# EAGLE design owl-digital-2 (EAGLE 9.6.1)
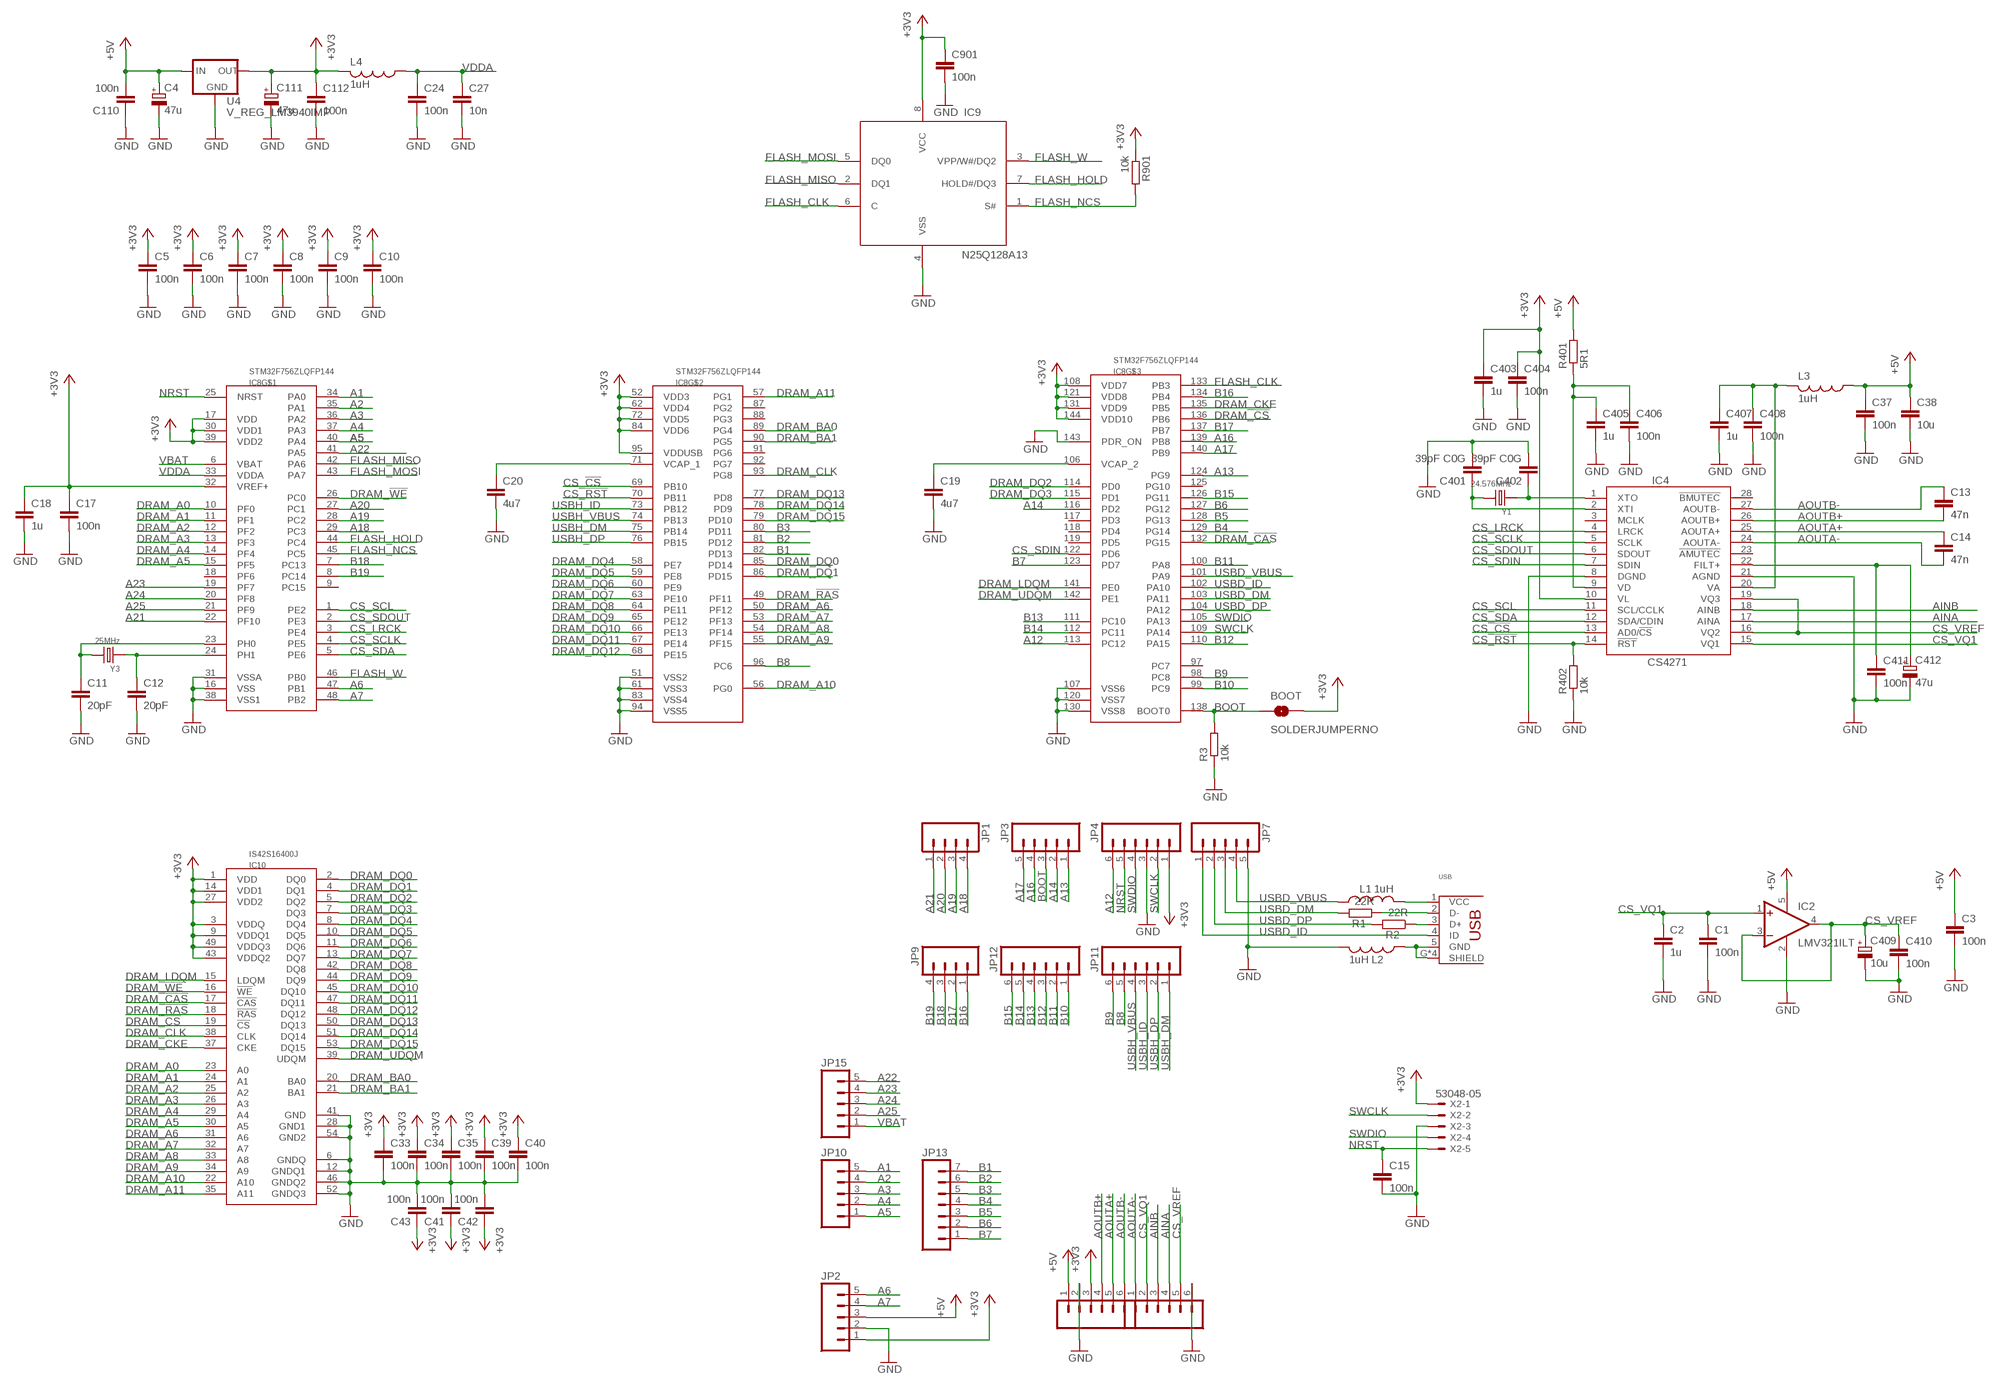
[diagram p0: schematic, sheet 1]

## Parts
BOOT  SOLDERJUMPERNO  [SJ_2S-NO]
C1  100n  C-EUC0603  [C0603]
C2  1u  C-EUC0603  [C0603]
C3  100n  C-EUC0603  [C0603]
C4  47u  CPOL-EU153CLV-0505  [CPOL-5]
C5  100n  C-EUC0603  [C0603]
C6  100n  C-EUC0603  [C0603]
C7  100n  C-EUC0603  [C0603]
C8  100n  C-EUC0603  [C0603]
C9  100n  C-EUC0603  [C0603]
C10  100n  C-EUC0603  [C0603]
C11  20pF  C-EUC0603  [C0603]
C12  20pF  C-EUC0603  [C0603]
C13  47n  C-EUC0603  [C0603]
C14  47n  C-EUC0603  [C0603]
C15  100n  C-EUC0603  [C0603]
C17  100n  C-EUC0603  [C0603]
C18  1u  C-EUC0603  [C0603]
C19  4u7  C-EUC0603  [C0603]
C20  4u7  C-EUC0603  [C0603]
C24  100n  C-EUC0603  [C0603]
C27  10n  C-EUC0603  [C0603]
C33  100n  C-EUC0603  [C0603]
C34  100n  C-EUC0603  [C0603]
C35  100n  C-EUC0603  [C0603]
C37  100n  C-EUC0603  [C0603]
C38  10u  C-EUC1206  [C1206]
C39  100n  C-EUC0603  [C0603]
C40  100n  C-EUC0603  [C0603]
C41  100n  C-EUC0603  [C0603]
C42  100n  C-EUC0603  [C0603]
C43  100n  C-EUC0603  [C0603]
C110  100n  C-EUC0603  [C0603]
C111  47u  CPOL-EU153CLV-0505  [CPOL-5]
C112  100n  C-EUC0603  [C0603]
C401  39pF C0G  C-EUC0603  [C0603]
C402  39pF C0G  C-EUC0603  [C0603]
C403  1u  C-EUC0603  [C0603]
C404  100n  C-EUC0603  [C0603]
C405  1u  C-EUC0603  [C0603]
C406  100n  C-EUC0603  [C0603]
C407  1u  C-EUC0603  [C0603]
C408  100n  C-EUC0603  [C0603]
C409  10u  CPOL-EU153CLV-0505  [CPOL-5]
C410  100n  C-EUC0603  [C0603]
C411  100n  C-EUC0603  [C0603]
C412  47u  CPOL-EU153CLV-0505  [CPOL-5]
C901  100n  C-EUC0603  [C0603]
IC2  LMV321ILT  LM321MF  [SOT23-5]
IC4  CS4271  [TSSOP28-0.65-9.7X4.4MM]
IC8  STM32F756ZLQFP144  [QFP50P2200X2200X160-144N]
IC9  N25Q128A13  [SO8W]
IC10  IS42S16400J  [TSOP54-400]
JP1  M04PTH  [1X04]
JP2  M05PTH  [1X05]
JP3  M05PTH  [1X05]
JP4  M06SIP  [1X06]
JP5  M06SIP  [1X06]
JP6  M06SIP  [1X06]
JP7  M05PTH  [1X05]
JP9  M04PTH  [1X04]
JP10  M05PTH  [1X05]
JP11  M06SIP  [1X06]
JP12  M06SIP  [1X06]
JP13  M07  [1X07]
JP15  M05PTH  [1X05]
L1  1uH  INDUCTOR  [0603]
L2  1uH  INDUCTOR  [0603]
L3  1uH  INDUCTOR  [0603]
L4  1uH  INDUCTOR  [0603]
R1  22R  R-EU_0603  [0603]
R2  22R  R-EU_0603  [0603]
R3  10k  R-EU_0603  [0603]
R401  5R1  R-EU_0603  [0603]
R402  10k  R-EU_0603  [0603]
R901  10k  R-EU_0603  [0603]
U4  V_REG_LM3940IMP  [SOT223]
USB  USB_HRS_ZX62-B-5PA(11)MICRO.B  [HRS_ZX62RD-AB-5P8]
X2  53048-05  [53048-05]
Y1  24.576MHz  SMD-CRYSTAL-8MHZ-20PF-20PPM(2P-5.0X3.2MM)  [X2-SMD-5.0X3.2X1.3MM]
Y3  25MHz  SMD-CRYSTAL-8MHZ-20PF-20PPM(2P-5.0X3.2MM)  [X2-SMD-5.0X3.2X1.3MM]

## Nets
+3V3: BOOT.2 C5.1 C6.1 C7.1 C8.1 C9.1 C10.1 C17.1 C18.1 C33.1 C34.1 C35.1 C39.1 C40.1 C41.1 C42.1 C43.1 C111.+ C112.1 C403.1 C404.1 C901.1 IC4.10(VL) IC8.17(VDD) IC8.30(VDD1) IC8.32(VREF+) IC8.39(VDD2) IC8.52(VDD3) IC8.62(VDD4) IC8.72(VDD5) IC8.84(VDD6) IC8.95(VDDUSB) IC8.108(VDD7) IC8.121(VDD8) IC8.131(VDD9) IC8.144(VDD10) IC9.8(VCC) IC10.1(VDD) IC10.3(VDDQ) IC10.9(VDDQ1) IC10.14(VDD1) IC10.27(VDD2) IC10.43(VDDQ2) IC10.49(VDDQ3) JP2.1 JP4.1 JP5.3 L4.2 R901.1 U4.3(OUT) X2.1
+5V [power]: C3.1 C4.+ C37.1 C38.1 C110.2 IC2.5(V+) JP2.3 JP5.1 L3.1 R401.2 U4.1(IN)
A1: IC8.34(PA0) JP10.5
A2: IC8.35(PA1) JP10.4
A3: IC8.36(PA2) JP10.3
A4: IC8.37(PA3) JP10.2
A5: IC8.40(PA4) JP10.1
A6: IC8.47(PB1) JP2.5
A7: IC8.48(PB2) JP2.4
A12: IC8.113(PC12) JP4.6
A13: IC8.124(PG9) JP3.1
A14: IC8.116(PD2) JP3.2
A16: IC8.139(PB8) JP3.4
A17: IC8.140(PB9) JP3.5
A18: IC8.29(PC3) JP1.4
A19: IC8.28(PC2) JP1.3
A20: IC8.27(PC1) JP1.2
A21: IC8.22(PF10) JP1.1
A22: IC8.41(PA5) JP15.5
A23: IC8.19(PF7) JP15.4
A24: IC8.20(PF8) JP15.3
A25: IC8.21(PF9) JP15.2
AINA: IC4.17(AINA) JP6.4
AINB: IC4.18(AINB) JP6.3
AOUTA+: C14.1 IC4.25(AOUTA+) JP5.5
AOUTA-: C14.2 IC4.24(AOUTA-) JP6.1
AOUTB+: C13.2 IC4.26(AOUTB+) JP5.4
AOUTB-: C13.1 IC4.27(AOUTB-) JP5.6
B1: IC8.82(PD13) JP13.7
B2: IC8.81(PD12) JP13.6
B3: IC8.80(PD11) JP13.5
B4: IC8.129(PG14) JP13.4
B5: IC8.128(PG13) JP13.3
B6: IC8.127(PG12) JP13.2
B7: IC8.123(PD7) JP13.1
B8: IC8.96(PC6) JP11.5
B9: IC8.98(PC8) JP11.6
B10: IC8.99(PC9) JP12.1
B11: IC8.100(PA8) JP12.2
B12: IC8.110(PA15) JP12.3
B13: IC8.111(PC10) JP12.4
B14: IC8.112(PC11) JP12.5
B15: IC8.126(PG11) JP12.6
B16: IC8.134(PB4) JP9.1
B17: IC8.137(PB7) JP9.2
B18: IC8.7(PC13) JP9.3
B19: IC8.8(PC14) JP9.4
BOOT: BOOT.1 IC8.138(BOOT0) JP3.3 R3.2
CS_!CS: IC4.13(AD0/!CS) IC8.69(PB10)
CS_!RST: IC4.14(!RST) IC8.70(PB11) R402.2
CS_LRCK: IC4.4(LRCK) IC8.3(PE4)
CS_SCL: IC4.11(SCL/CCLK) IC8.1(PE2)
CS_SCLK: IC4.5(SCLK) IC8.4(PE5)
CS_SDA: IC4.12(SDA/CDIN) IC8.5(PE6)
CS_SDIN: IC4.7(SDIN) IC8.122(PD6)
CS_SDOUT: IC4.6(SDOUT) IC8.2(PE3)
CS_VQ1: C1.1 C2.1 IC2.1(+IN) IC4.15(VQ1) JP6.2
CS_VREF: C409.+ C410.1 IC2.3(-IN) IC2.4(OUT) IC4.16(VQ2) IC4.19(VQ3) JP6.5
DRAM_!CAS: IC8.132(PG15) IC10.17(!CAS)
DRAM_!CS: IC8.136(PB6) IC10.19(!CS)
DRAM_!RAS: IC8.49(PF11) IC10.18(!RAS)
DRAM_!WE: IC8.26(PC0) IC10.16(!WE)
DRAM_A0: IC8.10(PF0) IC10.23(A0)
DRAM_A1: IC8.11(PF1) IC10.24(A1)
DRAM_A2: IC8.12(PF2) IC10.25(A2)
DRAM_A3: IC8.13(PF3) IC10.26(A3)
DRAM_A4: IC8.14(PF4) IC10.29(A4)
DRAM_A5: IC8.15(PF5) IC10.30(A5)
DRAM_A6: IC8.50(PF12) IC10.31(A6)
DRAM_A7: IC8.53(PF13) IC10.32(A7)
DRAM_A8: IC8.54(PF14) IC10.33(A8)
DRAM_A9: IC8.55(PF15) IC10.34(A9)
DRAM_A10: IC8.56(PG0) IC10.22(A10)
DRAM_A11: IC8.57(PG1) IC10.35(A11)
DRAM_BA0: IC8.89(PG4) IC10.20(BA0)
DRAM_BA1: IC8.90(PG5) IC10.21(BA1)
DRAM_CKE: IC8.135(PB5) IC10.37(CKE)
DRAM_CLK: IC8.93(PG8) IC10.38(CLK)
DRAM_DQ0: IC8.85(PD14) IC10.2(DQ0)
DRAM_DQ1: IC8.86(PD15) IC10.4(DQ1)
DRAM_DQ2: IC8.114(PD0) IC10.5(DQ2)
DRAM_DQ3: IC8.115(PD1) IC10.7(DQ3)
DRAM_DQ4: IC8.58(PE7) IC10.8(DQ4)
DRAM_DQ5: IC8.59(PE8) IC10.10(DQ5)
DRAM_DQ6: IC8.60(PE9) IC10.11(DQ6)
DRAM_DQ7: IC8.63(PE10) IC10.13(DQ7)
DRAM_DQ8: IC8.64(PE11) IC10.42(DQ8)
DRAM_DQ9: IC8.65(PE12) IC10.44(DQ9)
DRAM_DQ10: IC8.66(PE13) IC10.45(DQ10)
DRAM_DQ11: IC8.67(PE14) IC10.47(DQ11)
DRAM_DQ12: IC8.68(PE15) IC10.48(DQ12)
DRAM_DQ13: IC8.77(PD8) IC10.50(DQ13)
DRAM_DQ14: IC8.78(PD9) IC10.51(DQ14)
DRAM_DQ15: IC8.79(PD10) IC10.53(DQ15)
DRAM_LDQM: IC8.141(PE0) IC10.15(LDQM)
DRAM_UDQM: IC8.142(PE1) IC10.39(UDQM)
FLASH_CLK: IC8.133(PB3) IC9.6(C)
FLASH_HOLD: IC8.44(PC4) IC9.7(HOLD#/DQ3)
FLASH_MISO: IC8.42(PA6) IC9.2(DQ1)
FLASH_MOSI: IC8.43(PA7) IC9.5(DQ0)
FLASH_NCS: IC8.45(PC5) IC9.1(S#) R901.2
FLASH_W: IC8.46(PB0) IC9.3(VPP/W#/DQ2)
GND: C1.2 C2.2 C3.2 C4.- C5.2 C6.2 C7.2 C8.2 C9.2 C10.2 C11.2 C12.2 C15.2 C17.2 C18.2 C19.2 C20.2 C24.2 C27.2 C33.2 C34.2 C35.2 C37.2 C38.2 C39.2 C40.2 C41.2 C42.2 C43.2 C110.1 C111.- C112.2 C401.2 C402.2 C403.2 C404.2 C405.2 C406.2 C407.2 C408.2 C409.- C410.2 C411.2 C412.- C901.2 IC2.2(V-) IC4.8(DGND) IC4.21(AGND) IC8.16(VSS) IC8.31(VSSA) IC8.38(VSS1) IC8.51(VSS2) IC8.61(VSS3) IC8.83(VSS4) IC8.94(VSS5) IC8.107(VSS6) IC8.120(VSS7) IC8.130(VSS8) IC8.143(PDR_ON) IC9.4(VSS) IC10.6(GNDQ) IC10.12(GNDQ1) IC10.28(GND1) IC10.41(GND) IC10.46(GNDQ2) IC10.52(GNDQ3) IC10.54(GND2) JP2.2 JP4.3 JP5.2 JP6.6 JP7.5 L2.2 R3.1 R402.1 U4.2(GND) X2.3
N$1: L2.1 USB.5(GND) USB.G2(SHIELD) USB.G3(SHIELD) USB.G4(SHIELD) USB.G(SHIELD)
N$2: L1.2 USB.1(VCC)
N$4: R2.1 USB.3(D+)
N$5: R1.1 USB.2(D-)
N$11: C12.1 IC8.24(PH1) Y3.1
N$17: C11.1 IC8.23(PH0) Y3.2
N$18: C402.1 IC4.1(XTO) Y1.1
N$20: C411.1 C412.+ IC4.22(FILT+)
N$21: C401.1 IC4.2(XTI) Y1.2
N$33: C19.1 IC8.106(VCAP_2)
N$34: C20.1 IC8.71(VCAP_1)
NRST: C15.1 IC8.25(NRST) JP4.5 X2.5
SWCLK: IC8.109(PA14) JP4.2 X2.2
SWDIO: IC8.105(PA13) JP4.4 X2.4
USBD_DM: IC8.103(PA11) JP7.3 R1.2
USBD_DP: IC8.104(PA12) JP7.2 R2.2
USBD_ID: IC8.102(PA10) JP7.1 USB.4(ID)
USBD_VBUS: IC8.101(PA9) JP7.4 L1.1
USBH_DM: IC8.75(PB14) JP11.1
USBH_DP: IC8.76(PB15) JP11.2
USBH_ID: IC8.73(PB12) JP11.3
USBH_VBUS: IC8.74(PB13) JP11.4
VA: C407.1 C408.1 IC4.20(VA) L3.2
VBAT: IC8.6(VBAT) JP15.1
VD: C405.1 C406.1 IC4.9(VD) R401.1
VDDA: C24.1 C27.1 IC8.33(VDDA) L4.1
Unconnected: IC4.3(MCLK) IC4.23(!AMUTEC) IC4.28(!BMUTEC) IC8.9(PC15) IC8.18(PF6) IC8.87(PG2) IC8.88(PG3) IC8.91(PG6) IC8.92(PG7) IC8.97(PC7) IC8.117(PD3) IC8.118(PD4) IC8.119(PD5) IC8.125(PG10)

## Library data of the parts
BOOT = SparkFun:SOLDERJUMPER: Solder Jumper Standard SMD solder jumper. Used to automate production. Two varients : Normally Open and Normally Closed are the same, but have different paste layers. NC will have a large amount of paste and should jumper during reflow.
C1-C3 C5-C15 C17-C20 C24 C27 C33-C35 C37-C43 C110 C112 C401-C408 C410 C411 C901 = Rebel:C-EU: CAPACITOR, European symbol
C4 C111 C409 C412 = Rebel:CPOL-EU: POLARIZED CAPACITOR, European symbol
IC2 = linear:LM321?*: Low Power Single Op Amp Source: http://cache.national.com/ds/LM/LM321.pdf
IC4 = Rebel:CS4271
IC8 = James:STM32F756Z; OC_FARNELL: 2484975
IC9 = Rebel:N25Q128A13: N25Q128A13 Flash Memory SO8W; OC_FARNELL: 2253682
IC10 = James:IS42S16400J; OC_FARNELL: 2253831
JP1 JP9 = SparkFun:M04: Header 4 Standard 4-pin 0.1" header. Use with straight break away headers (SKU : PRT-00116), right angle break away headers (PRT-00553), swiss pins (PRT-00743), machine pins (PRT-00117), and female headers (PRT-00115). Molex polarized connector foot print use with SKU : PRT-08231 with associated crimp pins and housings. 1MM SMD Version SKU: PRT-10208
JP2 JP3 JP7 JP10 JP15 = SparkFun:M05: Header 5 Standard 5-pin 0.1" header. Use with straight break away headers (SKU : PRT-00116), right angle break away headers (PRT-00553), swiss pins (PRT-00743), machine pins (PRT-00117), and female headers (PRT-00115). Molex polarized connector foot print use with SKU : PRT-08230 with associated crimp pins and housings.
JP4-JP6 JP11 JP12 = SparkFun:M06: Header 6 Standard 6-pin 0.1" header. Use with straight break away headers (SKU : PRT-00116), right angle break away headers (PRT-00553), swiss pins (PRT-00743), machine pins (PRT-00117), and female headers (PRT-00115). Molex polarized connector foot print use with SKU : PRT-08094 with associated crimp pins and housings. NOTES ON THE VARIANTS LOCK and LOCK_LONGPADS... This footprint was designed to help hold the alignment of a through-hole component (i.e. 6-pin header) while soldering it into place. You may notice that each hole has been shifted either up or down by 0.005 of an inch from it's more standard position (which is a perfectly straight line). This slight alteration caused the pins (the squares in the middle) to touch the edges of the holes. Because they are alternating, it causes a "brace" to hold the component in place. 0.005 has proven to be the perfect amount of "off-center" position when using our standard breakaway headers. Although looks a little odd when you look at the bare footprint, once you have a header in there, the alteration is very hard to notice. Also, if you push a header all the way into place, it is covered up entirely on the bottom side. This idea of altering the position of holes to aid alignment will be further integrated into the Sparkfun Library for other footprints. It can help hold any component with 3 or more connection pins.
JP13 = SparkFun:M07: Header 7 Standard 7-pin 0.1" header. Use with straight break away headers (SKU : PRT-00116), right angle break away headers (PRT-00553), swiss pins (PRT-00743), machine pins (PRT-00117), and female headers (PRT-00115). NOTES ON THE VARIANTS LOCK and LOCK_LONGPADS... This footprint was designed to help hold the alignment of a through-hole component (i.e. 7-pin header) while soldering it into place. You may notice that each hole has been shifted either up or down by 0.005 of an inch from it's more standard position (which is usually a perfectly straight line). This slight alteration caused the pins (the squares in the middle) to touch the edges of the holes. Because they are alternating, it causes a "brace" to hold the header in place. 0.005 has proven to be the perfect amount of "off-center" position when using our standard breakaway headers. Although looks a little odd when you look at the bare footprint, once you have a header in there, the alteration is very hard to notice. Also, if you push a header all the way into place, it is covered up entirely on the bottom side. This idea of altering the position of holes to aid alignment will be further integrated into the Sparkfun Library for other footprints. It can help hold any component with 3 or more connection pins.
L1-L4 = Rebel:INDUCTOR; OC_FARNELL: 2288736
R1-R3 R401 R402 R901 = Rebel:R-EU_: RESISTOR, European symbol
U4 = James:V_REG_LM3940IMP: LM3940IMP Fixed LDO Voltage Regulator Farnell: 1469104; OC_FARNELL: 1469104
USB = Rebel:USB_HRS_ZX62-B-5PA(11)MICRO.B
X2 = con-molex:53?-05: CONNECTOR wire to board 1.25 mm (.049 inch) pitch header; MF: MOLEX; MPN: 53048-0510; OC_FARNELL: 9732926; OC_NEWARK: 57H4722
Y1 Y3 = Seeed-OPL-crystal-osctllator:SMD-CRYSTAL-8MHZ-20PF-20PPM(2P-5.0X3.2MM): 306010004; MPN: 5032/2P; VALUE: 5032/2p

## Net classes
1 power: width 0.178 mm, drill 0.305 mm, clearance 0.178 mm to class 0, clearance 0.178 mm

## Board
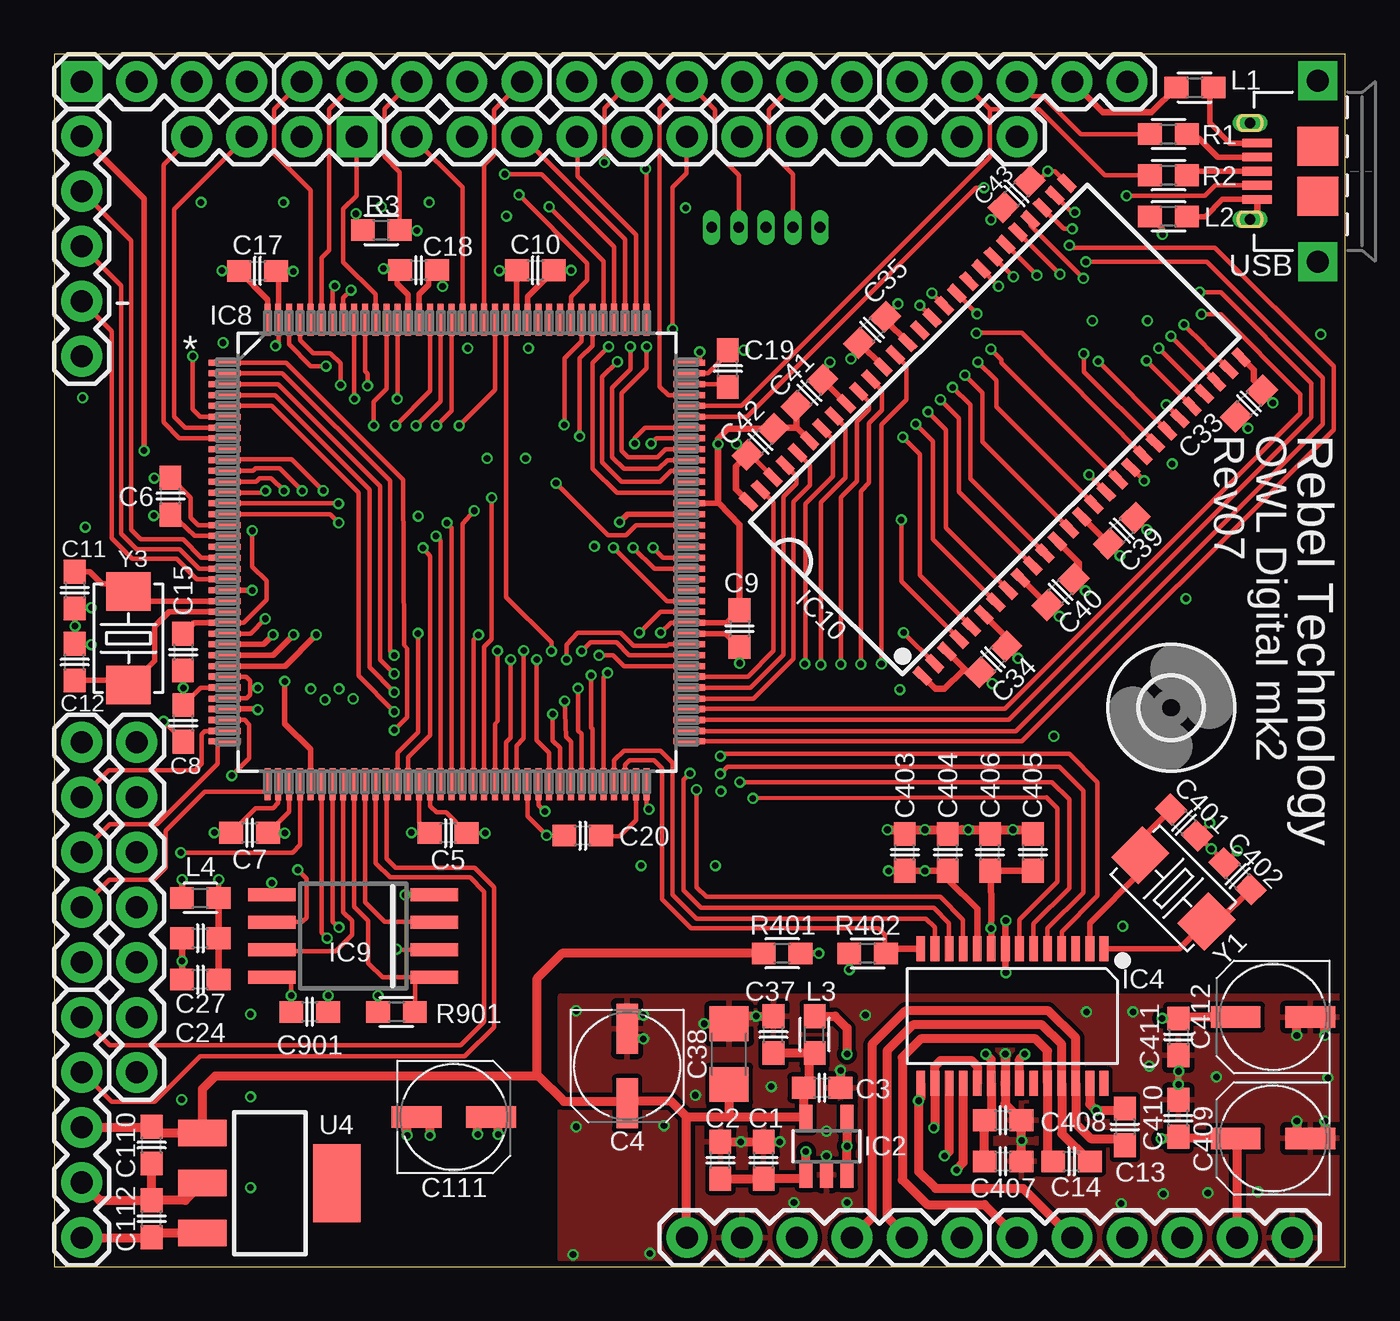
[diagram p1: board, top side]
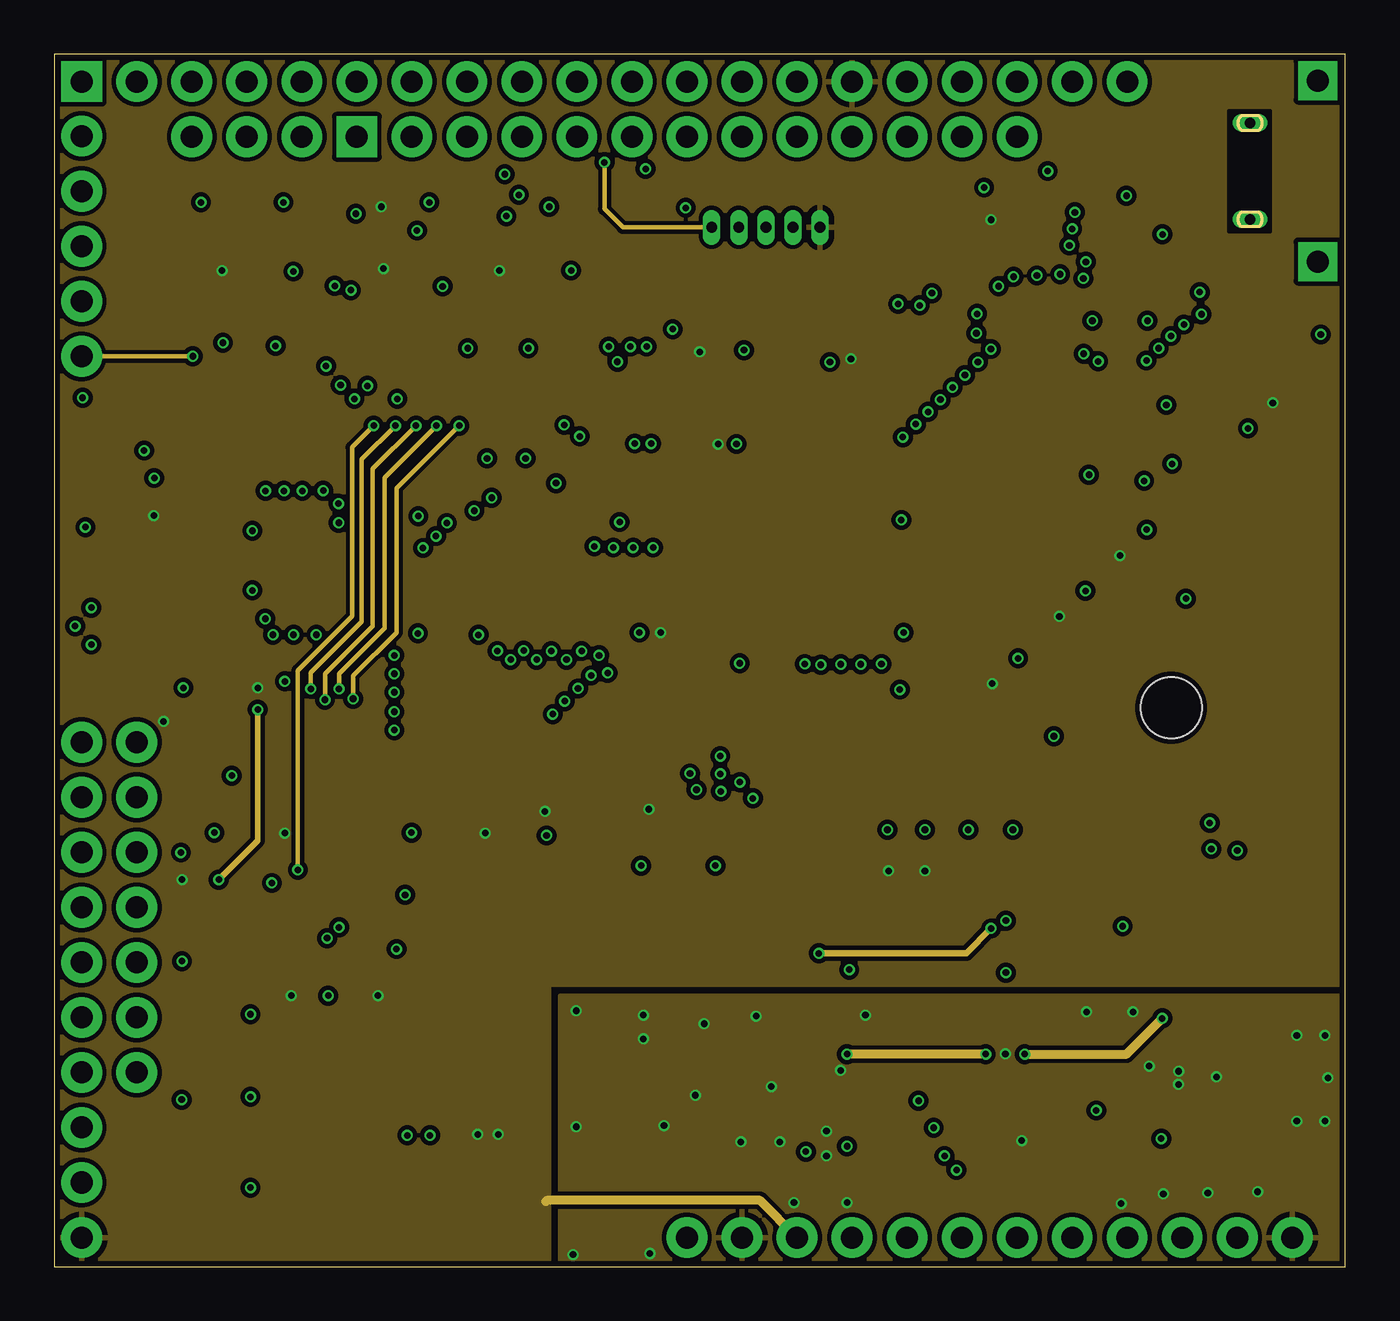
[diagram p2: board, inner layer InnerTop]
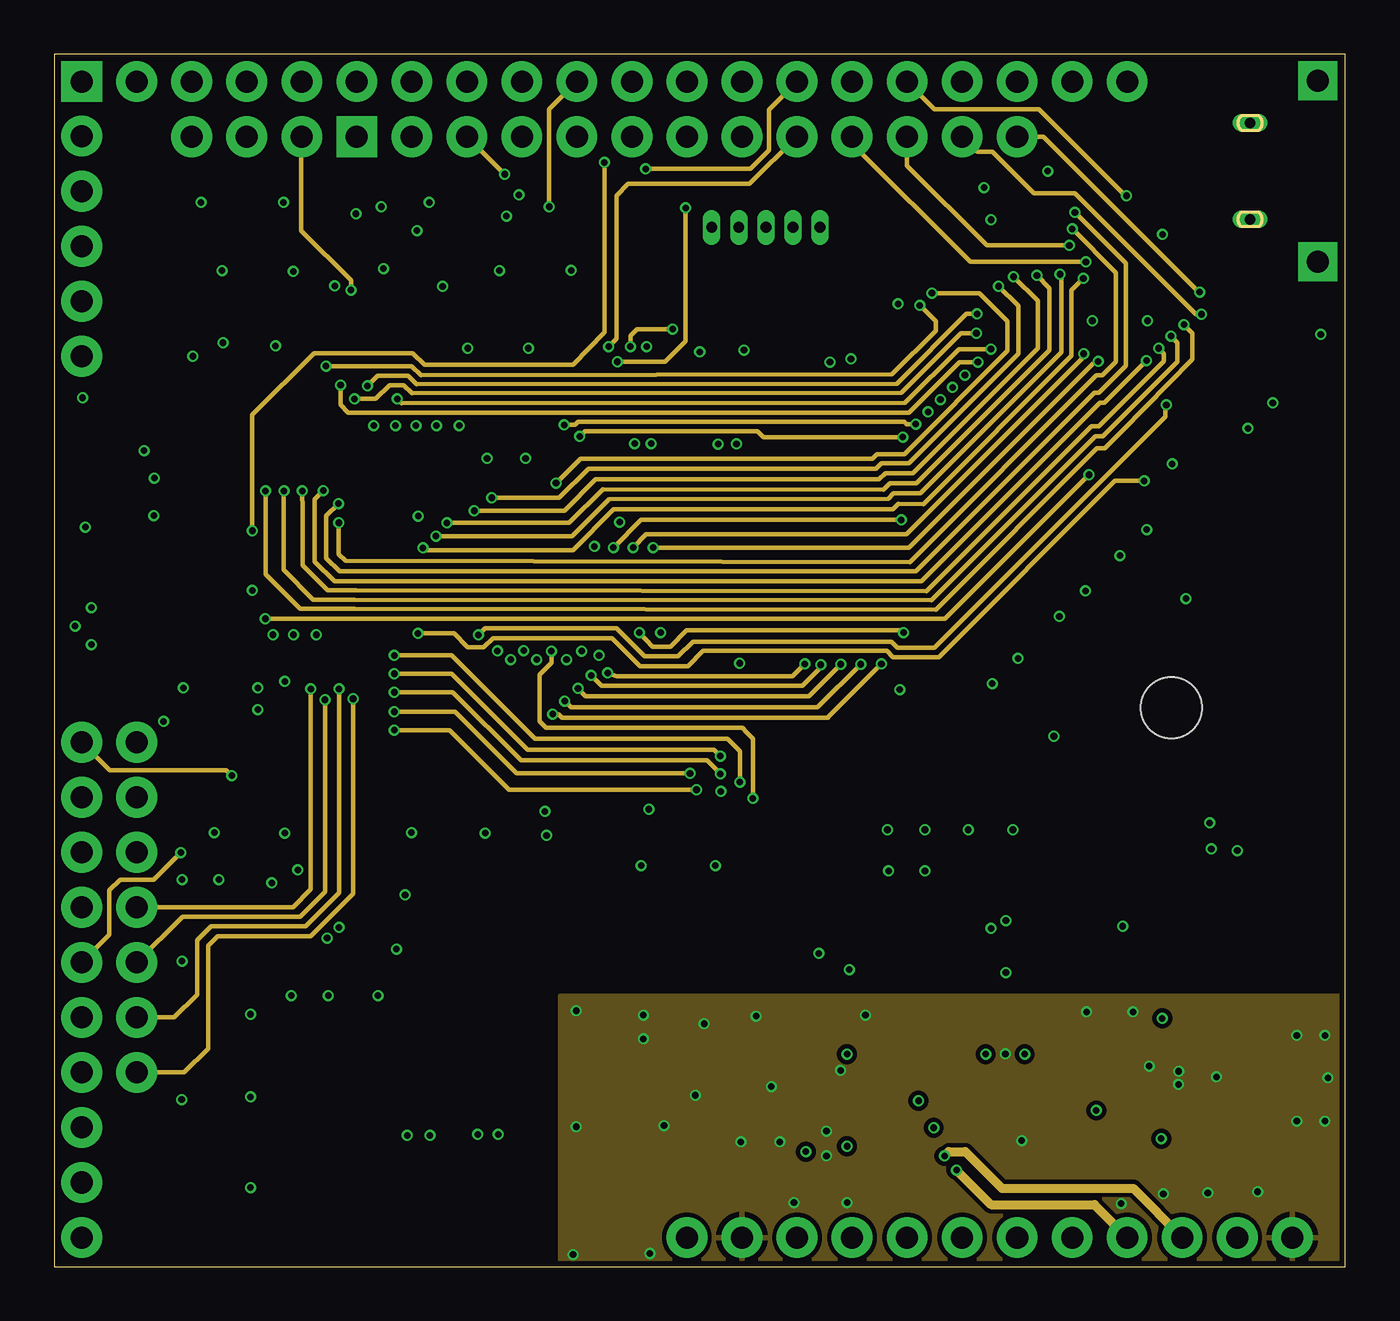
[diagram p3: board, inner layer InnerBottom]
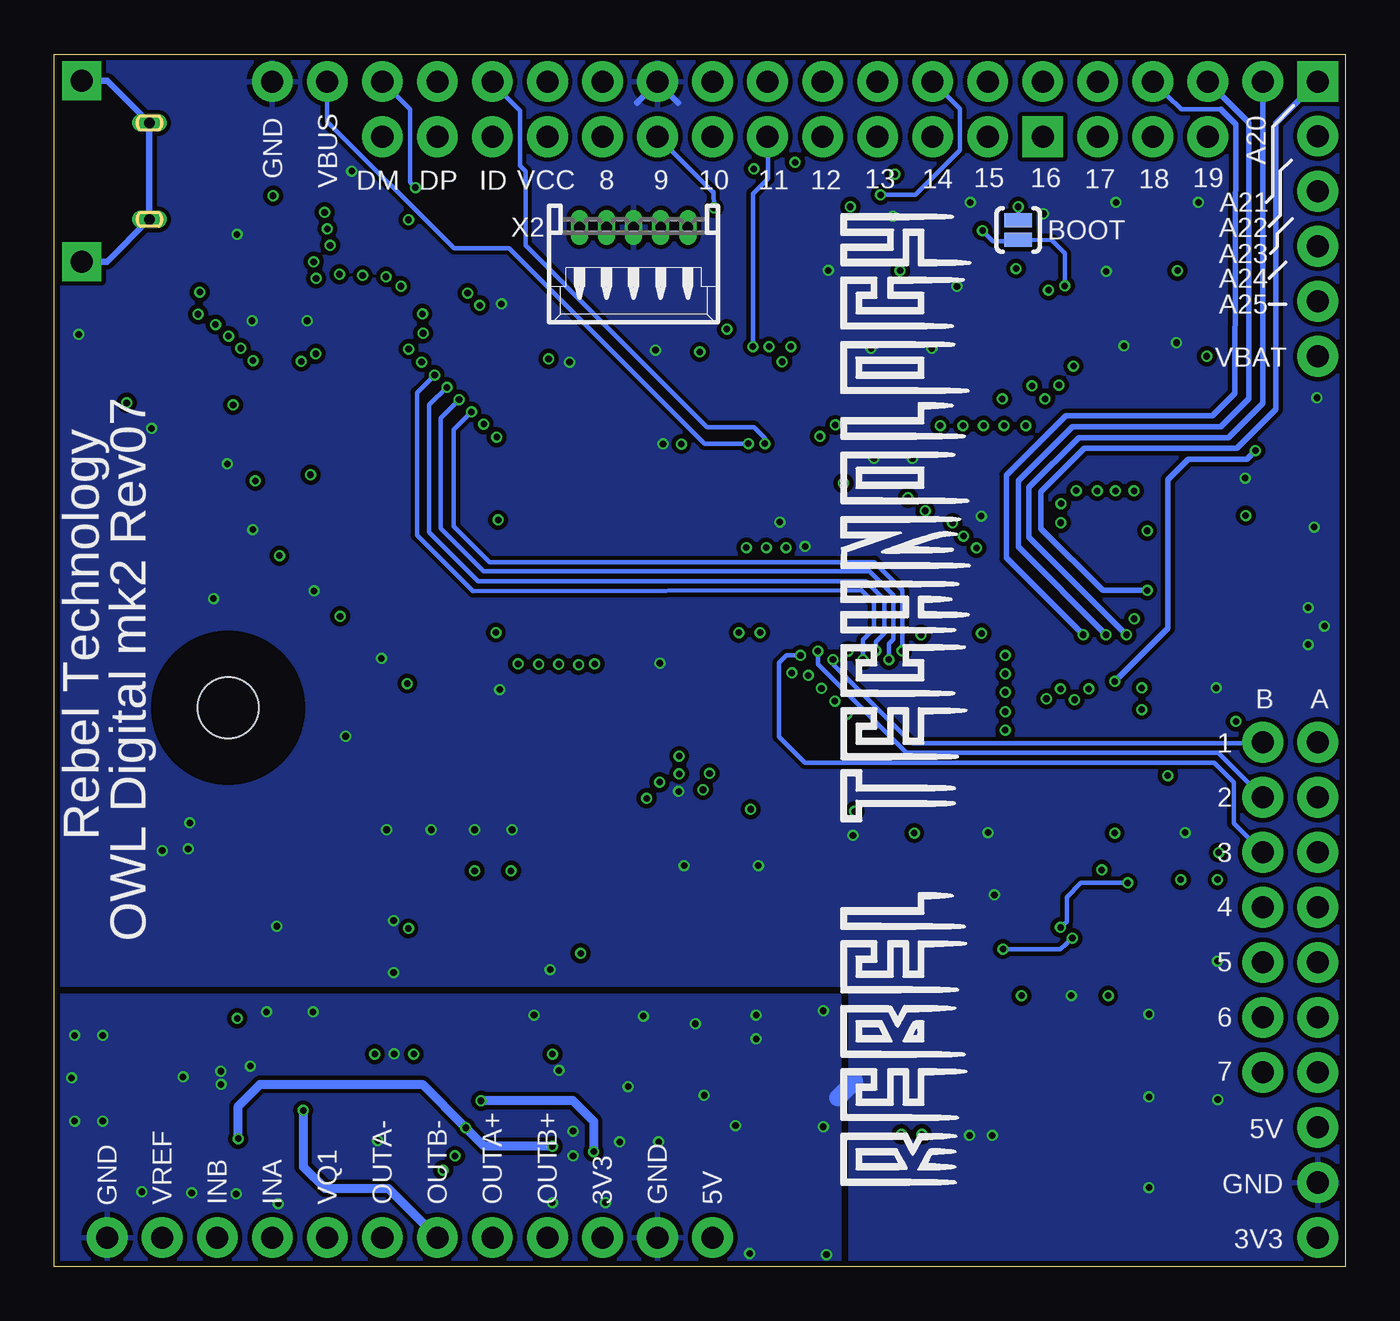
[diagram p4: board, bottom side, seen from below]

Size 59.6 x 55.94 mm. Coordinates in mm from the lower left corner, seen from the top.
Outline: 0,0 59.6,0 59.6,55.94 0,55.94 0,0
Copper layers (1*2*15*16): Top 0.035mm / dielectric 0.2mm / InnerTop 0.0175mm / dielectric 0.3mm / InnerBottom 0.0175mm / dielectric 0.2mm / Bottom 0.035mm
Design rules "SeeedStudio_4layer_DRU_no_angle_20140221": minimum track width 8mil, minimum drill 12mil, track to track 8mil, track to pad 8mil, pad to pad 8mil, via to via 8mil, smd to smd 0mil, copper to edge 10mil, drill to drill 8mil, minimum pad ring 6mil, minimum via ring 4mil, stop-mask expansion 4mil, vias tented up to drill 25mil, thermal gap 10mil

### Footprints (pad centres in the part's own frame; a part is rotated, then mirrored left to right if it is on the bottom)
SJ_2S-NO = smd 0.635 x 1.27: 1 -0.45,0; 2 0.45,0
C0603 = smd 1.1 x 1: 1 -0.85,0; 2 0.85,0
CPOL-5 = smd 2.3 x 1: + 1.725,0; - -1.725,0
C1206 = smd 1.6 x 1.8: 1 -1.4,0; 2 1.4,0
SOT23-5 = smd 0.6 x 1.2: 1 -0.95,-1.306; 2 0,-1.306; 3 0.95,-1.306; 4 0.95,1.306; 5 -0.95,1.306
TSSOP28-0.65-9.7X4.4MM = smd 0.4 x 1.15: 1 -4.225,-3.1; 2 -3.575,-3.1; 3 -2.925,-3.1; 4 -2.275,-3.1; 5 -1.625,-3.1; 6 -0.975,-3.1; 7 -0.325,-3.1; 8 0.325,-3.1; 9 0.975,-3.1; 10 1.625,-3.1; 11 2.275,-3.1; 12 2.925,-3.1; 13 3.575,-3.1; 14 4.225,-3.1; 15 4.225,3.1; 16 3.575,3.1; 17 2.925,3.1; 18 2.275,3.1; 19 1.625,3.1; 20 0.975,3.1; 21 0.325,3.1; 22 -0.325,3.1; 23 -0.975,3.1; 24 -1.625,3.1; 25 -2.275,3.1; 26 -2.925,3.1; 27 -3.575,3.1; 28 -4.225,3.1
QFP50P2200X2200X160-144N = smd 1.473 x 0.279: 1 -10.719,8.738; 2 -10.719,8.255; 3 -10.719,7.747; 4 -10.719,7.239; 5 -10.719,6.756; 6 -10.719,6.248; 7 -10.719,5.74; 8 -10.719,5.258; 9 -10.719,4.75; 10 -10.719,4.242; 11 -10.719,3.759; 12 -10.719,3.251; 13 -10.719,2.743; 14 -10.719,2.261; 15 -10.719,1.753; 16 -10.719,1.245; 17 -10.719,0.762; 18 -10.719,0.254; 19 -10.719,-0.254; 20 -10.719,-0.762; 21 -10.719,-1.245; 22 -10.719,-1.753; 23 -10.719,-2.261; 24 -10.719,-2.743; 25 -10.719,-3.251; 26 -10.719,-3.759; 27 -10.719,-4.242; 28 -10.719,-4.75; 29 -10.719,-5.258; 30 -10.719,-5.74; 31 -10.719,-6.248; 32 -10.719,-6.756; 33 -10.719,-7.239; 34 -10.719,-7.747; 35 -10.719,-8.255; 36 -10.719,-8.738; 73 10.719,-8.738; 74 10.719,-8.255; 75 10.719,-7.747; 76 10.719,-7.239; 77 10.719,-6.756; 78 10.719,-6.248; 79 10.719,-5.74; 80 10.719,-5.258; 81 10.719,-4.75; 82 10.719,-4.242; 83 10.719,-3.759; 84 10.719,-3.251; 85 10.719,-2.743; 86 10.719,-2.261; 87 10.719,-1.753; 88 10.719,-1.245; 89 10.719,-0.762; 90 10.719,-0.254; 91 10.719,0.254; 92 10.719,0.762; 93 10.719,1.245; 94 10.719,1.753; 95 10.719,2.261; 96 10.719,2.743; 97 10.719,3.251; 98 10.719,3.759; 99 10.719,4.242; 100 10.719,4.75; 101 10.719,5.258; 102 10.719,5.74; 103 10.719,6.248; 104 10.719,6.756; 105 10.719,7.239; 106 10.719,7.747; 107 10.719,8.255; 108 10.719,8.738 | smd 0.279 x 1.473: 37 -8.738,-10.719; 38 -8.255,-10.719; 39 -7.747,-10.719; 40 -7.239,-10.719; 41 -6.756,-10.719; 42 -6.248,-10.719; 43 -5.74,-10.719; 44 -5.258,-10.719; 45 -4.75,-10.719; 46 -4.242,-10.719; 47 -3.759,-10.719; 48 -3.251,-10.719; 49 -2.743,-10.719; 50 -2.261,-10.719; 51 -1.753,-10.719; 52 -1.245,-10.719; 53 -0.762,-10.719; 54 -0.254,-10.719; 55 0.254,-10.719; 56 0.762,-10.719; 57 1.245,-10.719; 58 1.753,-10.719; 59 2.261,-10.719; 60 2.743,-10.719; 61 3.251,-10.719; 62 3.759,-10.719; 63 4.242,-10.719; 64 4.75,-10.719; 65 5.258,-10.719; 66 5.74,-10.719; 67 6.248,-10.719; 68 6.756,-10.719; 69 7.239,-10.719; 70 7.747,-10.719; 71 8.255,-10.719; 72 8.738,-10.719; 109 8.738,10.719; 110 8.255,10.719; 111 7.747,10.719; 112 7.239,10.719; 113 6.756,10.719; 114 6.248,10.719; 115 5.74,10.719; 116 5.258,10.719; 117 4.75,10.719; 118 4.242,10.719; 119 3.759,10.719; 120 3.251,10.719; 121 2.743,10.719; 122 2.261,10.719; 123 1.753,10.719; 124 1.245,10.719; 125 0.762,10.719; 126 0.254,10.719; 127 -0.254,10.719; 128 -0.762,10.719; 129 -1.245,10.719; 130 -1.753,10.719; 131 -2.261,10.719; 132 -2.743,10.719; 133 -3.251,10.719; 134 -3.759,10.719; 135 -4.242,10.719; 136 -4.75,10.719; 137 -5.258,10.719; 138 -5.74,10.719; 139 -6.248,10.719; 140 -6.756,10.719; 141 -7.239,10.719; 142 -7.747,10.719; 143 -8.255,10.719; 144 -8.738,10.719
SO8W = smd 0.6 x 2.2: 1 -1.905,-3.75; 2 -0.635,-3.75; 3 0.635,-3.75; 4 1.905,-3.75; 5 1.905,3.75; 6 0.635,3.75; 7 -0.635,3.75; 8 -1.905,3.75
TSOP54-400 = smd 0.4 x 0.9: 1 -10.4,-5.68; 2 -9.6,-5.68; 3 -8.8,-5.68; 4 -8,-5.68; 5 -7.2,-5.68; 6 -6.4,-5.68; 7 -5.6,-5.68; 8 -4.8,-5.68; 9 -4,-5.68; 10 -3.2,-5.68; 11 -2.4,-5.68; 12 -1.6,-5.68; 13 -0.8,-5.68; 14 0,-5.68; 15 0.8,-5.68; 16 1.6,-5.68; 17 2.4,-5.68; 18 3.2,-5.68; 19 4,-5.68; 20 4.8,-5.68; 21 5.6,-5.68; 22 6.4,-5.68; 23 7.2,-5.68; 24 8,-5.68; 25 8.8,-5.68; 26 9.6,-5.68; 27 10.4,-5.68; 28 10.4,5.68; 29 9.6,5.68; 30 8.8,5.68; 31 8,5.68; 32 7.2,5.68; 33 6.4,5.68; 34 5.6,5.68; 35 4.8,5.68; 36 4,5.68; 37 3.2,5.68; 38 2.4,5.68; 39 1.6,5.68; 40 0.8,5.68; 41 0,5.68; 42 -0.8,5.68; 43 -1.6,5.68; 44 -2.4,5.68; 45 -3.2,5.68; 46 -4,5.68; 47 -4.8,5.68; 48 -5.6,5.68; 49 -6.4,5.68; 50 -7.2,5.68; 51 -8,5.68; 52 -8.8,5.68; 53 -9.6,5.68; 54 -10.4,5.68
1X04 = drill 1.016 pad 1.88 square: 1 0,0 | drill 1.016 pad 1.88: 2 2.54,0; 3 5.08,0; 4 7.62,0
1X05 = drill 1.016 pad 1.88: 1 0,0; 2 2.54,0; 3 5.08,0; 4 7.62,0; 5 10.16,0
1X06 = drill 1.016 pad 1.88: 1 0,0; 2 2.54,0; 3 5.08,0; 4 7.62,0; 5 10.16,0; 6 12.7,0
1X07 = drill 1.016 pad 1.88: 1 0,0; 2 2.54,0; 3 5.08,0; 4 7.62,0; 5 10.16,0; 6 12.7,0; 7 15.24,0
0603 = smd 1.1 x 1: 1 -0.85,0; 2 0.85,0
SOT223 = smd 1.219 x 2.235: 1 -2.311,-3.099; 2 0,-3.099; 3 2.311,-3.099 | smd 3.6 x 2.2: 4 0,3.099
2,8 = hole 2.8: 0,0
HRS_ZX62RD-AB-5P8 = smd 0.4 x 1.35: 1 1.3,2.275; 2 0.65,2.275; 3 0,2.275; 4 -0.65,2.275; 5 -1.3,2.275 | smd 1.8 x 1.9: D_0 -1.15,-0.525; D_1 1.15,-0.525 | drill 1 pad 1.8 square: G -4.175,-0.525; G2 4.175,-0.525 | drill 0.5 long: G3 -2.225,2.6; G4 2.225,2.6
53048-05 = drill 0.5 pad 0.698 long: 1 2.5,-1.25; 2 1.25,-1.25; 3 0,-1.25; 4 -1.25,-1.25; 5 -2.5,-1.25
X2-SMD-5.0X3.2X1.3MM = smd 1.778 x 2.032: 1 -2.159,0; 2 2.159,0

### Placement (x,y rotation side)
BOOT  15.1,47.83 90 bottom
C1  32.75,4.9 90 top
C2  30.75,4.9 90 top
C3  35.45,8.25 0 top
C4  26.45,9.25 270 top
C5  18.19,20 180 top
C6  5.37,35.54 90 top
C7  9.02,20.01 180 top
C8  5.97,25.06 90 top
C9  31.63,29.43 270 top
C10  22.22,45.97 0 top
C11  0.95,31.21 270 top
C12  0.95,27.89 90 top
C13  49.42,6.44 270 top
C14  46.96,4.85 180 top
C15  5.95,28.35 270 top
C17  9.39,45.94 0 top
C18  16.83,45.97 0 top
C19  31.09,41.43 90 top
C20  24.4,19.88 180 top
C24  6.75,13.24 180 top
C27  6.75,15.15 180 top
C33  55.15,39.82 225 top
C34  43.35,28.01 45 top
C35  37.76,43.22 45 top
C37  33.2,10.7 90 top
C38  31.15,9.8 90 top
C39  49.29,33.95 45 top
C40  46.46,31.13 45 top
C41  34.86,40.32 45 top
C42  32.6,38.06 225 top
C43  44.42,49.48 45 top
C110  4.5,5.6 90 top
C111  18.45,6.9 0 top
C112  4.5,2.2 90 top
C401  52.15,20.48 315 top
C402  54.63,18.01 135 top
C403  39.27,19.1 90 top
C404  41.25,19.1 90 top
C405  45.18,19.1 90 top
C406  43.2,19.1 90 top
C407  43.8,4.85 0 top
C408  43.8,6.75 0 top
C409  56.26,5.91 180 top
C410  51.89,6.84 90 top
C411  51.89,10.59 270 top
C412  56.26,11.51 180 top
C901  11.8,11.75 0 top
IC2  35.65,5.55 0 top
IC4  44.23,11.56 180 top
IC8  18.6,32.96 0 top
IC9  13.8,15.25 90 top
IC10  43.42,38.62 45 top
JP1  1.27,54.67 0 top
JP2  1.27,1.34 90 top
JP3  21.59,54.67 180 top
JP4  36.83,54.67 180 top
JP5  29.21,1.34 0 top
JP6  44.45,1.34 0 top
JP7  39.37,54.67 0 top
JP9  13.97,52.13 180 top
JP10  1.27,14.03 90 top
JP11  44.45,52.13 180 top
JP12  29.21,52.13 180 top
JP13  3.81,8.95 90 top
JP15  1.27,42 90 top
L1  52.65,54.4 0 top
L2  51.43,48.45 180 top
L3  35.1,10.7 90 top
L4  6.75,17 180 top
R1  51.43,52.25 180 top
R2  51.43,50.35 180 top
R3  15.1,47.83 0 top
R401  33.6,14.45 180 top
R402  37.55,14.45 0 top
R901  15.8,11.75 0 top
U4  9.95,3.85 270 top
U$1  [2,8]  51.56,25.78 0 top
USB  57.8,50.54 90 top
X2  32.85,46.7 180 bottom
Y1  51.67,17.45 135 top
Y3  3.43,28.99 90 top

### Tracks (layer width: path | path; a pad name or v marks a point on that pad's centre or on a via)
+3V3  (via drill 0.3)
  Top 0.204: IC8.30 8.85,27.22 9.05,27.02 9.05,26.75 | 9.05,26.75 9.05,26.39 8.88,26.21 8.52,26.21 8.49,26.25 8.45,26.21 IC8.32 | 15.84,45.76 C18.1 15.78,46.02 v15.2,46.05 | 55.76,40.49 C33.1 | 34.3,38.69 34.26,38.73 | IC9.8 11.05,13.35 10.95,13.24 v10.95,12.5 C901.1 | 42.18,27.41 C34.1 | 33.3,38.69 33.27,38.66 C42.1 | IC8.144 | IC8.84 28.46,29.71 v28,29.25 | IC8.62 22.36,21.29 v22.65,21 | IC8.72 27.34,21.23 v27.45,21.1 | v19.9,20 C5.1 18.09,20.95 17.65,20.95 17.35,21.25 IC8.52 | v19.9,20 | C404.1 41.3,18.25 | C43.1 43.97,49.02 v43.25,48.3 | IC8.108 29.8,41.7 v29.8,42.2 | 21.34,45.94 C10.1 | C17.1 v7.76,45.94 v7.75,45.95 | C8.1 5.6,24.46 5.6,24.6 v5.05,25.15 | v4.6,34.65 5.37,34.65 | IC8.39 10.85,20.99 C7.1 9.94,20 v10.65,20 | v9.4,26.7 9.05,26.7 9.05,26.75
  Top 0.205: IC8.17 6.49,33.73 5.75,34.4 5.75,34.69 C6.1 | v36.78,41.88 37.16,42.26 C35.1
  Top 0.25: IC8.84 31.06,29.71 C9.1 | IC8.131 16.34,44.84 15.84,45.34 15.84,45.76 | IC8.95 30.68,35.23
  Top 0.254: IC8.121 21.34,45.94 | v20.55,45.95 21.37,45.95 C10.1 | IC8.144 9.87,44.62 C17.1
  Top 0.305: IC10.43 C35.1 | IC10.9 C40.1 45.88,30.52 v46.4,30 | IC10.27 55.37,41.38 55.37,40.88 55.76,40.49 | IC10.14 C39.1 48.69,33.31 v49.2,32.8 | IC10.49 34.3,38.69 33.3,38.69 | 34.26,38.73 C41.1 | C9.1 31.63,34.22 30.68,35.23 30.65,35.26 v30.65,37.95 30.65,38.2 31.11,38.66 C42.1 | IC10.3 41.97,27.62 | 41.97,27.62 42.18,27.41 | R901.1 v14.95,12.5 | C34.1 42.79,27.41 v43.3,26.9 | IC10.1 40.68,26.65 41.1,26.65 41.97,27.52 41.97,27.62 | v56.25,39.85 55.76,40.34 C33.1 | v38.52,18.25 C403.1 41.3,18.25 41.3,17.81 42.6,16.5 IC4.10 | L4.2 v5.9,17.85
  Top 0.406: U4.3 4.69,1.54 C112.1 4.49,1.34 JP2.1 | v19.55,6.1 19.55,6.9 20.15,6.9 | 20.15,6.9 C111.+ | v20.5,6.1 20.5,6.7 20.15,6.9 | 5.37,34.65 C6.1
  InnerTop 0.406: JP5.3 32.58,3.05 22.75,3.05 22.7,3
  Bottom 0.204: BOOT.2 v15.1,48.9
  other vias: 40.19,18.25
  pour InnerTop: 61.15,56.95 61,13 22.85,13 22.85,-0.9 -1.5,-0.9 -1.35,56.95
  cutout InnerTop: 54.23,53.34 56.13,53.34 56.13,47.75 54.23,47.75
+5V
  Top 0.406: JP2.3 4.47,6.42 C110.2 4.8,6.15 6.86,6.15 U4.1 6.85,8.2 7.45,8.8 22.25,8.8 22.3,8.85 | 29.2,1.35 JP5.1 | 29.2,1.35 | 22.3,8.85 22.3,13.3 23.45,14.45 R401.2 | 29.2,1.35 JP5.1 29.2,6.9 | 29.2,6.9 31.2,6.9 | 31.2,6.9 34.66,6.9 | 34.66,6.9 IC2.5 | C38.1 31.15,7 arc90 31.2,6.9 | 29.2,6.9 28.48,7.62 26.45,7.62 | 22.3,8.85 23.52,7.62 26.45,7.62 | 26.45,7.62 C4.+ | 34.66,6.9 34.6,6.96 C3.1 34.85,8.5 34.85,9.55 L3.1 35.05,9.85 C37.1
A1  (via drill 0.3)
  Top 0.204: IC8.34 8.78,25.22 9,25 9,23.45 v8.2,22.65
  InnerBottom 0.204: JP10.5 2.56,22.9 7.95,22.9 v8.2,22.65
A2
  Top 0.204: IC8.35 6.96,24.71 6.8,24.55 6.8,23.2 6.5,22.9 2.52,22.9 JP10.4
A3
  Top 0.204: IC8.36 7.55,24.23 7.55,23.2 4.75,20.4 2.56,20.4 JP10.3
A4
  Top 0.204: IC8.37 9.85,21.9 6.95,21.89 5.15,20.1 5.15,18.4 4.6,17.85 2.55,17.85 JP10.2
A5  (via drill 0.3)
  Top 0.204: IC8.40 11.36,19.46 11,19.1 v5.85,19.1
  InnerBottom 0.204: v5.85,19.1 4.6,17.85 3.05,17.85 2.55,17.35 2.55,15.31 JP10.1
A6
  Top 0.204: IC8.47 14.84,18.61 15.5,17.95 19.2,17.95 19.85,17.3 19.85,11.3 18.75,10.2 2.57,10.2 JP2.5
A7
  Top 0.204: IC8.48 15.35,18.8 15.75,18.4 19.4,18.4 20.3,17.5 20.3,11.05 18.95,9.7 6.75,9.7 4.65,7.6 2.65,7.6 1.29,8.96 JP2.4
A12  (via drill 0.3)
  Top 0.204: IC8.113 25.35,46.4 v22.85,48.9
  InnerBottom 0.204: v22.85,48.9 22.85,53.39 JP4.6
A13
  Top 0.204: JP3.1 20.3,53.38 20.3,51.3 19.84,50.84 IC8.124
A14  (via drill 0.3)
  Top 0.204: IC8.116 23.86,44.76 24.6,45.5 24.6,46.3 v21.45,49.45
  Bottom 0.204: v21.45,49.45 19.85,49.45 17.8,51.5 17.8,53.42 JP3.2
A16
  Top 0.204: JP3.4 14,54.64 14,54.65 13.95,54.65 12.7,53.4 12.7,46.9 12.35,46.55 IC8.139
A17
  Top 0.204: IC8.140 11.84,49.66 10.15,51.35 10.15,53.39 JP3.5
A18  (via drill 0.3)
  Top 0.254: v12.1,29.15 10.66,27.71 IC8.29
  Bottom 0.204: 5.75,53.4 7.57,53.4 JP1.4
  Bottom 0.254: v12.1,29.15 15.65,32.7 15.65,36.5 12.9,39.25 6.15,39.25 5.1,40.3 5.05,52.7 5.75,53.4
A19  (via drill 0.3)
  Top 0.254: IC8.28 10.11,28.21 v11.05,29.15
  Bottom 0.254: v11.05,29.15 15.1,33.2 15.1,36.25 12.6,38.75 5.75,38.75 4.45,40.05 4.45,52.77 JP1.3
A20  (via drill 0.3)
  Top 0.254: IC8.27 9.67,28.72 v10.1,29.15
  Bottom 0.254: v10.1,29.15 14.6,33.65 14.6,35.95 12.3,38.25 5.4,38.25 3.81,39.84 JP1.2
A21  (via drill 0.3)
  Top 0.254: IC8.22 9.15,31.21
  Top 0.305: 9.15,31.21 v9.15,31.2
  Bottom 0.254: v9.15,31.2 11.2,31.2 14.05,34.05 14.05,35.75 12.05,37.75 5,37.75 3.2,39.55 3.2,52.75 JP1.1 | JP1.1 | JP1.1 1.25,54.7
A22  (via drill 0.3)
  Top 0.204: JP15.5 1.27,52.08
  Top 0.254: IC8.41 11.84,23.86 10.65,25.05 v10.65,27 | v4.15,37.65 4.15,49.28 JP15.5
  Bottom 0.254: v10.65,27 8.2,29.45 8.2,36.3 7.25,37.25 4.55,37.25 v4.15,37.65
A23
  Top 0.204: 1.27,49.59 JP15.4 3.55,47.34 3.55,34 4,33.55 5.95,33.55
  Top 0.205: IC8.19 6.79,32.71 5.95,33.55
A24
  Top 0.204: 1.27,47.05 JP15.3 3.1,45.25 3.1,33.8 3.8,33.1 5.8,33.1
  Top 0.205: IC8.20 6.7,32.2 5.8,33.1
A25
  Top 0.204: 1.27,44.51 JP15.2 2.65,43.16 2.65,33.6 3.6,32.65 5.65,32.65
  Top 0.205: IC8.21 6.58,31.72 5.65,32.65
AINA  (via drill 0.3)
  Top 0.406: IC4.17 41.3,5.29 41.16,5.15 v41.1,5.1 | 52.1,1.37 JP6.4
  InnerBottom 0.406: JP6.4 49.81,3.6 43.75,3.6 42.05,5.29 41.3,5.29 v41.1,5.1
AINB  (via drill 0.3)
  Top 0.406: IC4.18 41.95,4.8 v41.65,4.45
  InnerBottom 0.406: v41.65,4.45 43.25,2.85 48.02,2.85 JP6.3
  Bottom 0.406: 49.5,1.37 JP6.3
AOUTA+
  Top 0.406: JP5.5 39.4,1.37 39.4,1.35 38.45,2.3 38.45,9.95 39.65,11.15 45.6,11.15 46.51,10.24 IC4.25 46.51,6.13 C14.1
AOUTA-
  Top 0.406: JP6.1 42.95,2.85 40.3,2.85 39.15,4 39.15,9.65 40,10.5 45.3,10.5 45.85,9.95 IC4.24 45.85,4.99 C14.2
AOUTB+
  Top 0.406: JP5.4 37.75,2.26 37.75,10.25 39.3,11.8 45.9,11.8 47.16,10.54 IC4.26 47.16,6.59 47.85,5.9 49.01,5.9 C13.2
AOUTB-  (via drill 0.3)
  Top 0.406: IC4.27 47.8,7.5 v48.1,7.2 49.41,7.2 C13.1
  Bottom 0.406: JP5.6 44.17,3.6 47.1,3.6 48.1,4.6 v48.1,7.2
B1  (via drill 0.3)
  Top 0.204: IC8.82 28.37,28.72 28.3,28.65 26.75,28.65 26.15,29.25 24.15,29.25 23.65,28.7 v23.65,28
  Bottom 0.204: JP13.7 3.85,24.15 20,24.15 23.65,27.8 v23.65,28
B2  (via drill 0.3)
  Top 0.204: IC8.81 26.54,28.21 25.95,28.8 24.75,28.8 v24.35,28.4
  Bottom 0.204: v24.35,28.4 24.35,27.8 20.25,23.7 5.86,23.7 JP13.6
B3  (via drill 0.3)
  Top 0.204: IC8.80 26.29,27.71 25.8,28.2 v25.15,28.2
  Bottom 0.204: JP13.5 5.15,20.45 5.15,22.35 6.05,23.25 24.95,23.25 26.15,24.45 26.15,27.85 25.8,28.2 v25.15,28.2
B4  (via drill 0.3)
  Top 0.204: IC8.129 17.35,40.4 v15.75,38.8
  InnerTop 0.204: v15.75,38.8 14.2,37.25 14.2,29.75 11.85,27.4 v11.85,26.65
  InnerBottom 0.204: JP13.4 11.02,16.57 11.85,17.4 v11.85,26.65
B5  (via drill 0.3)
  Top 0.204: IC8.128 17.84,39.94 v16.7,38.8
  InnerTop 0.204: v16.7,38.8 14.7,36.8 14.7,29.55 12.5,27.35 v12.5,26.15
  InnerBottom 0.204: v12.5,26.15 12.5,17.3 11.35,16.15 5.93,16.15 JP13.3
B6  (via drill 0.3)
  Top 0.204: IC8.127 18.34,39.49 v17.65,38.8
  InnerTop 0.204: v13.15,26.65 13.15,27.35 15.25,29.45 15.25,36.4 v17.65,38.8
  InnerBottom 0.204: JP13.2 5.54,11.49 6.6,12.55 6.6,15.05 7.25,15.7 11.6,15.7 13.15,17.25 v13.15,26.65
B7  (via drill 0.3)
  Top 0.204: v18.7,38.8 20.35,40.45 IC8.123 | IC8.123
  InnerTop 0.204: v13.8,26.2 13.8,27.25 15.8,29.25 15.8,35.9 v18.7,38.8
  InnerBottom 0.204: v13.8,26.2 13.8,17.2 11.85,15.25 7.55,15.25 7.1,14.8 7.1,10.05 6,8.95 JP13.1
B8  (via drill 0.3)
  Top 0.204: IC8.96 25.99,35.71 24.85,36.8 24.85,41.7 v25.6,42.45
  InnerBottom 0.204: v25.6,42.45 25.95,42.8 25.95,49.4 26.5,49.95 32.11,49.95 JP11.5
B9  (via drill 0.3)
  Top 0.204: v26,41.75 25.3,41.05 25.3,37.1 26.18,36.22 27.96,36.22 28.47,36.72 IC8.98
  InnerBottom 0.204: v26,41.75 28.2,41.75 29.15,42.7 v29.15,48.85
  Bottom 0.204: v29.15,48.85 29.17,49.6 29.22,49.6 JP11.6
B10  (via drill 0.3)
  Top 0.204: IC8.99 28.31,37.21 27.9,36.8 26.3,36.8 25.75,37.35 25.75,40.55 26.6,41.4 v26.6,42.45 | v28.55,43.25 28.55,49.8 29.2,50.45 JP12.1
  InnerBottom 0.204: v28.55,43.25 26.9,43.25 26.6,42.95 v26.6,42.45
B11  (via drill 0.3)
  Top 0.204: IC8.100 28.21,37.71 27.85,37.35 26.5,37.35 26.2,37.65 26.2,40.3 27.35,41.45 v27.35,42.45
  InnerBottom 0.204: 26.65,52.11 JP12.2
  Bottom 0.204: v27.35,42.45 27.35,49.5 26.65,50.2 26.65,52.11 JP12.2
B12
  Top 0.204: IC8.110 26.85,47.6 24.15,50.3 24.15,52.11 JP12.3
B13
  Top 0.204: IC8.111 26.34,47.4 26.3,47.45 21.62,52.13 JP12.4
B14  (via drill 0.3)
  Top 0.204: IC8.112 25.84,47.06 22.5,50.4 v20.8,50.4
  InnerBottom 0.204: v20.8,50.4 20.78,50.4 JP12.5
B15
  Top 0.204: IC8.126 18.85,49.79 JP12.6
B16
  Top 0.204: IC8.134 14.84,44.86 13.35,46.35 13.35,48.8 13.95,49.4 13.95,52.11 JP9.1
B17  (via drill 0.3)
  Top 0.204: IC8.137 13.34,44.69 v13.7,45.05
  InnerBottom 0.204: v13.7,45.05 13.7,45.5 11.4,47.8 11.4,52.1 JP9.2
B18
  Top 0.204: IC8.7 6.7,38.7 6.69,38.7 6.05,38.7 5.55,39.2 5.55,48.79 JP9.3
B19
  Top 0.204: IC8.8 5.78,38.22 5.05,38.95 5.05,50.83 6.3,52.08
  Top 0.254: 6.3,52.08 6.35,52.08 JP9.4
BOOT  (via drill 0.3)
  Top 0.204: JP3.3 15.25,53.41 15.25,51.2 15.95,50.5 R3.2 v16.75,47.8 | IC8.138 12.86,45.16 v12.95,45.25
  Bottom 0.204: v16.75,47.8 16.26,47.31 15.14,47.31 BOOT.1 13.55,47.35 12.95,46.75 v12.95,45.25
CS_!CS
  Top 0.204: IC4.13 40.66,15.64 40.25,16.05 34.85,16.05
  Top 0.205: 34.85,16.05 29.65,16.05 28.55,17.15 28.55,23.25 28,23.8 26.3,23.8 25.85,23.35 IC8.69
CS_!RST
  Top 0.205: 38.35,14.66 38.35,15.3 38.05,15.6 29.4,15.6 28.05,16.95 28.05,23 27.7,23.35 26.55,23.35 26.35,23.15 IC8.70
  Top 0.305: IC4.14 38.35,14.66 R402.2
CS_LRCK  (via drill 0.3)
  Top 0.204: IC4.4 46.51,15.46 48.15,17.1 48.15,22.35 46.85,23.65 30.86,23.65 v30.75,23.55 | IC8.3 10.34,40.71 15.05,36 15.05,28 v15.7,27.35
  InnerBottom 0.204: v15.7,27.35 18.35,27.35 21.85,23.85 30.45,23.85 v30.75,23.55
CS_SCL  (via drill 0.3)
  Top 0.204: IC4.11 41.95,15.99 40.9,17.05 34.85,17.05 | IC8.1 10.7,41.7 16.1,36.3 16.15,28.7 16.3,28.5 16.3,25.35 v15.7,24.75
  Top 0.205: 34.85,17.05 30.1,17.05 29.65,17.5 v29.65,22
  InnerBottom 0.205: v29.65,22 21,22 18.25,24.75 v15.7,24.75
CS_SCLK  (via drill 0.3)
  Top 0.204: IC4.5 45.85,15.61 47.5,17.25 47.5,21.95 46.4,23.05 31.07,23.05 v30.75,22.73 | IC8.4 10.2,40.2 14.55,35.85 14.55,27.65 v15.7,26.5
  InnerBottom 0.204: v15.7,26.5 18.4,26.5 21.55,23.35 30.13,23.35 v30.75,22.73
CS_SDA  (via drill 0.3)
  Top 0.204: IC4.12 41.3,15.85 40.6,16.55 34.85,16.55 | IC8.5 10.03,39.72 14.05,35.7 14.05,27.25 v15.7,25.6
  Top 0.205: 34.85,16.55 29.85,16.55 29.05,17.35 29.05,22.45 v29.35,22.75
  InnerBottom 0.204: v15.7,25.6 18.5,25.6 20.6,23.5
  InnerBottom 0.205: 20.6,23.5 21.35,22.75 v29.35,22.75
CS_SDIN  (via drill 0.3)
  Top 0.204: IC4.7 44.55,16 46.3,17.75 46.3,21.15 45.8,21.65 v32.25,21.6 | IC8.122 20.86,30.89 22.95,28.8 v22.95,28.4
  InnerBottom 0.204: v22.95,28.4 22.95,27.85 22.4,27.3 22.4,25.15 22.7,24.85 31.76,24.85 31.98,24.63 32.25,24.36 v32.25,21.6
CS_SDOUT  (via drill 0.3)
  Top 0.204: IC4.6 45.2,15.8 46.85,17.45 46.85,21.55 46.05,22.35 v31.65,22.35 | IC8.2 10.53,41.22 15.5,36.25 15.5,28.4 v15.7,28.2
  InnerBottom 0.204: v15.7,28.2 18.35,28.2 22.2,24.35 31.08,24.35 31.65,23.78 v31.65,22.35
CS_VQ1  (via drill 0.3)
  Top 0.406: JP6.2 44.73,3.6 40.7,3.6 39.91,4.39 39.9,6.5 v39.9,7.65 40.01,7.75 IC4.15 | C2.1 C1.1 34.7,4.05 IC2.1 v34.7,5.3
  Bottom 0.406: v39.9,7.65 35.65,7.65 34.7,6.7 v34.7,5.3
CS_VREF  (via drill 0.3)
  Top 0.254: 51.97,5.91 C410.1
  Top 0.406: IC4.19 42.6,9.23 42.33,9.51 40.93,9.51 40.66,9.23 IC4.16 40.66,6.5 v40.6,6.4 | 51.97,5.91 C409.+ 54.61,5.83 JP6.5 | C410.1 51.8,5.9 v51.1,5.9 | IC2.3 v36.6,5.55 IC2.4
  Bottom 0.406: v51.1,5.9 51.1,7.4 50.1,8.4 42.6,8.4 v40.6,6.4 39.75,5.55 v36.6,5.55
DRAM_!CAS  (via drill 0.3)
  Top 0.204: IC10.17 43.73,41.7 43.73,41.84 v43.24,42.33 | IC8.132 15.85,40.05 v15.84,40.03
  InnerBottom 0.204: v43.24,42.33 41.76,42.33 39.28,39.86 16.05,39.82 v15.84,40.03
DRAM_!CS  (via drill 0.3)
  Top 0.204: IC10.19 44.67,43.08 42.59,43.08 v42.57,43.06 | IC8.136 13.85,40.02 v13.86,40.03
  InnerBottom 0.204: v42.57,43.06 41.86,43.07 39.1,40.32 16.52,40.28 16.14,40.67 15.49,40.67 14.85,40.03 v13.86,40.03
DRAM_!RAS  (via drill 0.3)
  Top 0.204: IC10.18 v50.31,36.25 | IC8.49 15.85,23.7 16.8,24.65 16.8,24.77 v16.79,29.22
  InnerBottom 0.204: v50.31,36.25 48.97,36.25 40.84,28.12 38.71,28.12 38.43,28.4 29.95,28.4 29.25,27.7 27.05,27.7 25.75,29 20.25,29 19.83,28.58 19.09,28.58 18.46,29.22 v16.79,29.22
DRAM_!WE  (via drill 0.3)
  Top 0.204: IC10.16 v47.77,36.53 | IC8.26 9.06,29.2 v9.74,29.89
  InnerBottom 0.204: v47.77,36.53 41.12,29.89 v9.74,29.89
DRAM_A0  (via drill 0.3)
  Top 0.204: IC10.23 v50.42,41.8 | IC8.10 8.2,37.21 8.24,37.24 10.95,37.24 v12.42,35.8
  InnerBottom 0.204: v12.42,35.8 12.03,35.41 12.03,32.52 12.94,31.62 40.02,31.62 48.26,39.86 48.47,39.86 v50.42,41.8
DRAM_A1  (via drill 0.3)
  Top 0.204: IC10.24 v50.98,42.37 | IC8.11 9.19,36.72 9.3,36.83 10.42,36.83 v11.46,35.79
  InnerBottom 0.204: v11.46,35.79 11.46,34.84 11.46,32.36 12.63,31.2 13.93,31.2 40.27,31.16 47.87,38.76 48.23,38.76 51.23,41.77 51.23,42.12 v50.98,42.37
DRAM_A2  (via drill 0.3)
  Top 0.204: IC8.12 9.32,36.22 9.48,36.37 10.03,36.37 v10.61,35.79 | v51.55,42.93 52.63,41.85 52.73,41.75 IC10.25
  InnerBottom 0.204: v51.55,42.93 51.85,42.63 51.85,41.75 48.4,38.3 48.05,38.3 40.48,30.74 13.86,30.77 11.96,30.77 10.59,32.15 10.59,35.77 v10.61,35.79
DRAM_A3  (via drill 0.3)
  Top 0.204: IC8.13 9.67,35.71 v9.76,35.79 | v52.15,43.47 53.11,42.5 53.21,42.4 IC10.26
  InnerBottom 0.204: v52.15,43.47 52.54,43.07 52.54,41.86 49.29,38.55 48.49,37.75 48.13,37.75 40.69,30.31 13.86,30.35 11.35,30.35 9.76,31.94 9.76,34.04 v9.76,35.79
DRAM_A4  (via drill 0.3)
  Top 0.204: IC8.14 13.05,35.23 v13.12,35.21 | IC10.29 46.97,48.64 v47.12,48.64
  InnerBottom 0.204: v13.12,35.21 12.56,34.65 12.56,32.68 13.17,32.08 39.77,32.08 48.01,40.32 48.23,40.32 49.47,41.56 49.47,46.29 v47.12,48.64
DRAM_A5  (via drill 0.3)
  Top 0.204: IC8.15 12.44,34.72 12.74,34.72 v13.14,34.32 | IC10.30 46.6,47.88 v46.99,47.88
  InnerBottom 0.204: v13.14,34.32 13.14,32.87 13.45,32.55 39.49,32.51 48.11,41.12 48.39,41.12 49.01,41.74 49.01,45.86 v46.99,47.88
DRAM_A6  (via drill 0.3)
  Top 0.204: IC8.50 16.34,23.5 17.35,24.51 17.35,32.78 v17.03,33.16 | v47.51,45.59 45.06,48.04 IC10.31
  InnerBottom 0.204: v17.03,33.16 17.13,33.06 23.94,33.06 25.83,34.94 38.71,34.95 38.96,35.2 40.11,35.18 46.96,42.02 46.96,45.05 v47.51,45.59
DRAM_A7  (via drill 0.3)
  Top 0.204: IC8.53 17.84,33.5 v17.63,33.71 | IC10.32 v46.43,45.79 | IC10.32
  InnerBottom 0.204: v17.63,33.71 23.91,33.71 25.6,35.4 38.5,35.42 38.75,35.67 39.99,35.69 46.49,42.19 46.49,45.73 v46.43,45.79
DRAM_A8  (via drill 0.3)
  Top 0.204: IC8.54 18.34,34.09 v18.13,34.31 | IC10.33 v45.36,45.73 | v45.36,45.73
  InnerBottom 0.204: v18.13,34.31 23.77,34.31 25.32,35.86 38.29,35.85 38.57,36.13 39.81,36.15 45.94,42.28 45.94,45.15 v45.36,45.73
DRAM_A9  (via drill 0.3)
  Top 0.204: IC8.55 18.85,34.27 v19.39,34.87 | IC10.34 v44.29,45.67
  InnerBottom 0.204: v19.39,34.87 23.55,34.87 25,36.32 38.08,36.32 38.36,36.61 39.63,36.61 45.4,42.37 45.4,44.56 v44.29,45.67
DRAM_A10  (via drill 0.3)
  Top 0.204: IC10.22 v51.34,39.75 | IC8.56 19.36,28.92 v19.59,29.15
  InnerBottom 0.204: v19.59,29.15 v19.6,29.15 19.9,29.45 25.95,29.45 27.25,28.15 28.8,28.15 29.48,28.83 38.64,28.83 38.93,28.55 40.62,28.55 51.29,39.21 51.29,39.7 v51.34,39.75
DRAM_A11  (via drill 0.3)
  Top 0.204: IC10.35 v43.59,45.23 | v20.2,35.47 20.19,34.13 20.19,28.94 19.85,28.6 IC8.57
  InnerBottom 0.204: v20.2,35.47 23.31,35.47 24.66,36.82 37.94,36.82 38.18,37.06 39.46,37.06 44.51,42.11 44.51,44.32 v43.59,45.23
DRAM_BA0  (via drill 0.3)
  Top 0.204: IC8.89 27.7,32.2 v26.73,33.18 | IC10.20 47.54,41.29 47.54,42.1 v47.52,42.12
  InnerBottom 0.204: v26.73,33.18 27.33,33.78 39.35,33.78 47.54,41.97 47.52,41.99 v47.52,42.12
DRAM_BA1  (via drill 0.3)
  Top 0.204: IC8.90 28.11,32.71 v27.65,33.18 | IC10.21 v48.19,41.77
  InnerBottom 0.204: v48.19,41.77 48.11,41.69 47.97,41.69 39.46,33.18 v27.65,33.18
DRAM_CKE  (via drill 0.3)
  Top 0.204: IC10.37 v42.6,43.96 | IC8.135 14.36,41.31 14.46,41.2 v14.46,40.64
  InnerBottom 0.204: v42.6,43.96 42.11,43.96 38.89,40.74 16.74,40.71 16.35,41.1 14.92,41.1 v14.46,40.64
DRAM_CLK  (via drill 0.3)
  Top 0.204: IC10.38 v40.52,44.91 | v23.17,36.15 25.56,33.75 26.4,33.75 26.86,34.21 IC8.93
  InnerBottom 0.204: v23.17,36.15 24.3,37.28 37.76,37.28 37.97,37.49 39.24,37.49 44.01,42.25 44.01,43.62 42.71,44.91 v40.52,44.91
DRAM_DQ0  (via drill 0.3)
  Top 0.204: IC10.2 v39.21,29.25 | IC8.85 27.98,30.22 v27.02,29.25
  InnerBottom 0.204: v39.21,29.25 39.11,29.35 29.2,29.35 28.45,28.6 27.62,28.6 v27.02,29.25
DRAM_DQ1  (via drill 0.3)
  Top 0.204: IC10.4 39.1,31.62 v39.1,34.45 | IC8.86 28.28,30.7 v25.81,33.18
  InnerBottom 0.204: v39.1,34.45 27.08,34.45 v25.81,33.18
DRAM_DQ2  (via drill 0.3)
  Top 0.204: IC10.5 39.95,31.9 39.95,37.49 v39.17,38.27 | 24.41,38.3 v24.26,38.3 24.25,38.31 24.25,41.9 24.85,42.5 IC8.114
  InnerBottom 0.204: v39.17,38.27 32.74,38.27 32.46,38.55 24.5,38.55 v24.25,38.3 v24.26,38.3
DRAM_DQ3  (via drill 0.3)
  Top 0.204: IC10.7 40.55,33.56 40.55,38.09 v39.77,38.87 | IC8.115 24.34,42.69 23.55,41.9 v23.55,38.84 v23.55,38.83
  InnerBottom 0.204: v39.77,38.87 39.35,38.87 39.24,38.98 24.18,38.98 24.04,38.83 v23.55,38.83
DRAM_DQ4  (via drill 0.3)
  Top 0.204: IC10.8 41.15,34.1 41.15,38.62 v40.34,39.43 | IC8.58 20.35,25.03 20.46,25.19 v20.46,28.4
  Bottom 0.204: v40.34,39.43 41.15,38.62 41.15,34.17 39.49,32.51 21.74,32.51 20.44,31.2 20.44,28.42 v20.46,28.4
DRAM_DQ5  (via drill 0.3)
  Top 0.204: IC10.10 41.76,35.76 41.76,39.15 v40.91,40 | IC8.59 20.86,24.19 21.07,24.41 v21.07,28
  Bottom 0.204: v40.91,40 41.76,39.15 41.76,34.06 39.77,32.08 21.96,32.08 20.86,30.98 20.86,28.95 21.07,28.73 v21.07,28
DRAM_DQ6  (via drill 0.3)
  Top 0.204: IC10.11 42.28,36.36 42.28,39.75 v41.47,40.57 | v21.67,28.42 21.67,24.37 21.34,24.04 IC8.60
  Bottom 0.204: v41.47,40.57 42.28,39.75 42.28,33.88 40.02,31.62 22.13,31.62 21.28,30.77 21.28,29.22 21.67,28.83 v21.67,28.42
DRAM_DQ7  (via drill 0.3)
  Top 0.204: IC10.13 42.85,38.05 42.85,40.32 v42.04,41.13 | v22.27,28 22.27,24.28 22.84,23.71 IC8.63
  Bottom 0.204: v42.04,41.13 42.85,40.32 42.85,33.74 40.27,31.16 22.34,31.2 21.77,30.63 21.77,29.43 22.27,28.92 v22.27,28
DRAM_DQ8  (via drill 0.3)
  Top 0.204: IC10.42 39.35,41.56 39.35,40 38.18,38.83 v38.18,27.8 | IC8.64 23.35,23.94 23.02,24.27 v23.02,25.49
  InnerBottom 0.204: 35.74,25.36 v38.18,27.8
  InnerBottom 0.205: v23.02,25.49 23.29,25.49 23.45,25.33 35.71,25.33 35.74,25.36
DRAM_DQ9  (via drill 0.3)
  Top 0.204: IC10.44 38.22,40.42 38.22,39.51 37.62,38.9 37.62,36.17 37.23,35.78 v37.23,27.79 | IC8.65 23.86,24.22 23.62,24.45 v23.57,26.09
  InnerBottom 0.204: v23.57,26.09 23.86,25.8 35.24,25.8 v37.23,27.79
DRAM_DQ10  (via drill 0.3)
  Top 0.204: IC10.45 37.62,39.9 37.62,39.54 37.05,38.98 37.05,36.24 36.31,35.49 v36.31,27.79 | IC8.66 24.34,24.57 24.18,24.73 v24.18,26.67
  InnerBottom 0.204: v36.31,27.79 34.84,26.32 24.54,26.32 v24.18,26.67
DRAM_DQ11  (via drill 0.3)
  Top 0.204: IC10.47 36.52,38.73 36.52,36.39 35.39,35.26 v35.39,27.77 | 24.78,24.94 v24.78,27.27
  Top 0.205: IC8.67 24.85,24.81 24.78,24.87 24.78,24.94
  InnerBottom 0.204: v35.39,27.77 35.39,27.64 34.54,26.79 25.27,26.79 v24.78,27.27
DRAM_DQ12  (via drill 0.3)
  Top 0.204: v34.65,27.8 34.68,27.84 34.68,35.19 35.96,36.46 35.96,38.16 IC10.48 | IC8.68 25.35,27.19 v25.55,27.39
  InnerBottom 0.204: v34.65,27.8 34.08,27.24 25.95,27.24 v25.55,27.39
DRAM_DQ13
  Top 0.204: IC8.77 32.28,26.21 34.12,28.05 34.12,35.28 34.89,36.06 34.89,36.96 IC10.50
DRAM_DQ14
  Top 0.204: IC8.78 32.15,26.72 33.66,28.23 33.66,35.51 34.26,36.11 34.26,36.47 IC10.51
DRAM_DQ15
  Top 0.204: IC8.79 32.02,27.22 33.2,28.4 33.2,35.26 IC10.53
DRAM_LDQM  (via drill 0.3)
  Top 0.204: IC10.15 43.49,39.68 43.49,40.88 v42.64,41.73 | IC8.141 11.36,42.74 11.95,42.15 12.75,42.15 13.22,41.68 v13.22,40.67
  InnerBottom 0.204: v42.64,41.73 41.79,41.73 39.46,39.4 13.58,39.4 13.22,39.75 v13.22,40.67
DRAM_UDQM  (via drill 0.3)
  Top 0.204: IC10.39 v39.95,44.35 | IC8.142 10.85,42.55 11.85,41.55 v12.55,41.55
  InnerBottom 0.204: v39.95,44.35 40.69,43.61 40.69,43.18 38.68,41.17 16.95,41.13 16.5,41.55 v12.55,41.55
FLASH_CLK  (via drill 0.3)
  Top 0.204: IC9.6 10.06,15.9 11.45,15.9 11.65,16.1 11.65,17.9 v11.25,18.3 | IC8.133 15.35,40.5 14.75,39.9 v14.75,38.8
  InnerTop 0.204: v14.75,38.8 13.75,37.8 13.75,30 11.25,27.5 v11.25,18.3
FLASH_HOLD
  Top 0.204: IC8.44 13.34,20.11 13.35,20.05 13.35,16.35 13.75,15.95 13.75,15.3 13,14.55 10.45,14.55 10.45,14.6 10.06,14.6 IC9.7
FLASH_MISO  (via drill 0.3)
  Top 0.204: IC8.42 12.35,15.4 v12.6,15.15 | IC9.2 15.84,14.62 v15.8,14.65
  Bottom 0.204: v15.8,14.65 13.15,14.65 v12.6,15.15
FLASH_MOSI  (via drill 0.3)
  Top 0.204: IC8.43 12.86,15.91 v13.15,15.65 | v10.05,17.7 IC9.5
  Bottom 0.204: v10.05,17.7 12.2,17.7 12.86,17.04 12.86,15.91 v13.15,15.65
FLASH_NCS
  Top 0.204: R901.2 16.65,13.35 IC9.1 15.15,13.35 14.5,14 14.5,15.95 13.85,16.6 13.85,20.3 IC8.45
FLASH_W
  Top 0.204: IC9.3 17.54,15.9 15.25,15.9 14.35,16.8 14.35,20.5 14.36,20.5 IC8.46
GND  (via drill 0.3)
  Top 0.204: v53.34,20.47 C401.2 | v54.61,19.19 C402.2 | C6.2 5.37,36.78 5.35,36.45 5.35,36.38 v4.62,36.38 | 17.29,45.94 C18.2 17.9,45.95 v17.93,45.23 | C10.2 23.4,45.97 v23.86,45.96 | v11.04,45.91 C17.2 | 10.36,43.7 IC8.143 | v31.84,42.28 C19.2 31.04,42.08 30.18,41.22 IC8.107 | v16.5,20.02 16.96,20 C5.2 16.84,20.49 IC8.51 | C20.2 v22.73,19.89 21.85,20.77 IC8.61 | v31.64,27.84 31.63,28.27 C9.2 | 38.4,43.64 C35.2 v38.96,44.42 | C33.2 v55.11,38.67 | v50.43,34 C39.2 | C40.2 v47.61,31.17 | 43.95,29.04 C34.2 v44.49,28.06 | R402.1 v36.7,13.7 | IC9.4 v16.2,17.15 | C901.2 v12.65,12.5 | IC10.52 32.07,37.52 | C41.2 35.67,41.13 35.67,41.6 v35.81,41.73 | IC10.28 46.2,50.55 v45.86,50.55 45.39,50.08 C43.2 | 10.36,43.61 10.36,42.62 v10.22,42.48 | IC8.38 10.34,21.39 10.1,21.15 9.31,21.15 C7.2 v7.4,20.02 | 52.78,19.9 54.05,18.63 | v13.93,48.58 13.93,48.12 R3.1 | IC8.31 6.77,26.72 C8.2 v5.97,26.7 5.95,26.7 C15.2
  Top 0.205: IC8.16 6.64,34.21 6.3,34.55 6.3,35.46 C6.2
  Top 0.25: IC8.83 31.01,29.2 C9.2 | IC8.120 21.85,44.75 C10.2 | IC8.130 16.84,44.86 17.29,45.3 17.29,45.94
  Top 0.254: 10.36,43.7 10.36,45.82 C17.2 | IC8.94 26.47,34.72 v26.1,34.35 | v51.9,8.4 C410.2 | C11.2 0.95,29.63 v0.97,29.55 0.95,29.32 C12.2 | 1.7,28.7 0.9,28.7 | 0.95,30.4 1.67,30.4 v1.72,30.4 | v1.72,28.7 1.7,28.7 | 1.7,28.7 | v51.16,47.62 51.16,47.88 L2.2
  Top 0.305: IC10.41 38.4,43.64 | IC10.12 47.31,32.47 47.31,31.73 C40.2 | IC10.6 43.95,29.04 | IC10.46 C41.2 | IC10.54 31.47,35.86 31.47,36.92 C42.2 | C411.2 51.89,9.09 51.9,9.05 | 51.9,9.05 v51.91,9.01 | C24.2 v5.9,14.09 C27.2 | 16.3,6.47 C111.- | v51.9,8.4 51.9,9.05 | v43.93,15.96 43.91,15.94 IC4.8 43.91,13.59 v43.93,13.56 | C42.2 32.07,37.52 | v31.5,37.95 C42.2
  Top 0.406: v57.36,10.66 57.36,11.44 57.25,11.55 57.95,11.55 C412.- 58.02,11.55 58.7,11.55 58.66,11.51 v58.66,10.66 | C112.2 C110.1 | U4.2 6.05,3.05 C112.2 | JP2.2 2.1,3.05 C112.2 | v16.3,6.05 16.3,6.47 | v17.35,6.05 17.35,6.75 | C2.2 C1.2 v33.5,5.75 | 52.78,19.9 C401.2 | v57.36,6.71 57.36,5.99 57.4,5.95 57.95,5.95 C409.- | 58.65,6 v58.65,6.7 v58.66,6.71 | v43.91,9.81 IC4.21 43.91,7.5 C408.2 C407.2 | C4.- 26.5,11.85 26.7,11.6 v27.2,11.6 | v36.3,9.05 C3.2 | C38.2 31.65,11.65 31.7,11.65 31.7,11.55 v32.4,11.55 C37.2 | v30,11.2 31.2,11.2 | v27.2,10.5 26.65,10.5 | v38.47,20.15 39.37,20.15 | 39.37,20.15 41.45,20.15 | 43.18,20.15 41.91,20.15 41.45,20.15 | 43.18,20.15 44.98,20.15 C405.2 | C403.2 39.27,20.05 39.37,20.15 | C404.2 41.45,20.15 | C406.2 43.18,19.97 43.18,20.15 | IC2.2 v35.65,5.1
  Bottom 0.204: JP4.3 31.75,54.65
  Bottom 0.305: 30.8,53.7 31.75,54.65 32.7,53.7
  Bottom 0.813: 23.42,7.79 22.65,8.55
  other vias: 42.2,20.15 44.25,20.15 40.19,20.15 53.41,19.27 44.66,5.81 31.7,5.75 24.1,11.8 24.1,6.45 23.95,0.55 58.8,8.7 37.45,11.6 47.65,11.75 49.8,11.75 50.55,9.25 51.2,3.35 53.25,3.4 53.65,8.75 36.6,2.95 33.1,8.3 28.15,6.5 29.6,7.9 35.65,6.25 49.25,2.9 55.55,3.45 27.5,0.6 34.15,2.95 27.09,18.5 30.52,18.5 9.06,11.64 9.06,7.83 5.89,7.7 46.15,24.46 30.78,21.93 39.03,26.62 49.32,15.7 51.61,37.04 19.98,37.29 21.76,37.29 21.89,42.37 16.81,34.62 47.92,43.64 50.46,43.64 9.06,3.64 1.44,34.12 1.31,40.09 7.79,42.63 6.78,49.1 10.59,49.1 17.32,49.1 20.87,48.47 19.09,42.37 58.46,43.01 52.24,30.82 24.94,33.23
  pour Bottom: 61,57 61,13 22.85,13 22.85,-0.9 -1.5,-0.9 -1.5,57
  pour Bottom: 61,12.5 61,-0.9 23.35,-0.9 23.35,12.5
  pour InnerBottom: 61,12.5 61,-1.66 23.35,-1.66 23.35,12.5
  pour Top: 61,12.5 61,-2.04 23.35,-2.04 23.35,12.5
  pour InnerTop: 61,12.5 61,-1.28 23.35,-1.28 23.35,12.5
N$1
  Top 0.254: USB.5 53.92,49.24 53.13,48.45 L2.1
  Top 0.305: USB.5 55.53,48.6 USB.G3
  Bottom 0.305: USB.G2 57.15,54.72 USB.G4 USB.G3 57.15,46.37 USB.G
N$2
  Top 0.254: USB.1 54.27,51.84 53.34,52.77 53.34,54.24 L1.2
N$4
  Top 0.254: USB.3 52.47,50.54 R2.1
N$5
  Top 0.254: USB.2 53.71,51.19 52.83,52.07 52.46,52.07 R1.1
N$11
  Top 0.254: IC8.24 5.32,30.22 4.65,29.55 4.65,27.95 3.6,26.9 3.6,26.83 Y3.1 3.34,27.04 C12.1
N$17
  Top 0.254: IC8.23 4,30.7 3.5,31.2 3.48,31.2 Y3.2 3.08,31.5 2.2,31.5 1.64,32.06 C11.1
N$18
  Top 0.254: C402.1 53.74,15.92 Y1.1 51.93,14.66 IC4.1
N$20  (via drill 0.3)
  Top 0.406: C412.+ 51.96,11.51 C411.1 v51.16,11.44 v51.15,11.45 | IC4.22 44.55,9.55 v44.8,9.8
  InnerTop 0.406: v44.8,9.8 49.5,9.8 v51.15,11.45
N$21
  Top 0.254: C401.1 50.14,19.67 Y1.2 50.14,18.19 47.8,15.85 IC4.2
N$33
  Top 0.204: IC8.106 30.71,40.71 C19.1
N$34
  Top 0.204: IC8.71 26.85,20.6 26.1,19.85 25.28,19.85
  Top 0.305: 25.28,19.85 C20.1
NRST  (via drill 0.3)
  Top 0.204: IC8.25 8.75,29.71 9.8,30.76 9.8,31.65 9.15,32.3 v9.15,33.95 | JP4.5 26.62,54.67 25.4,53.45 v25.4,50.95
  Top 0.254: IC8.25 6.46,29.71 C15.1
  InnerTop 0.204: v25.4,50.95 25.4,48.8 26.25,47.95 X2.5
  InnerBottom 0.204: v9.15,33.95 9.15,39.3 12,42.15 16.55,42.15 17.1,41.6 23.95,41.6 25.4,43.1 v25.4,50.95
SWCLK  (via drill 0.3)
  Top 0.204: IC8.109 27.34,50.62 v27.3,50.65 | X2.2 34.1,50.4 33,51.5 33,53.38 JP4.2
  InnerBottom 0.204: v27.3,50.65 32.15,50.65 33,51.5 33,53.38 JP4.2
SWDIO
  Top 0.204: IC8.105 28.35,40.2 27.95,40.6 27.95,53.41 JP4.4 30.5,53.38 30.5,51.45 31.6,50.35 X2.4
USBD_DM  (via drill 0.3)
  Top 0.204: JP7.3 44.48,54.64 45.15,54 45.65,54 47.4,52.25 48.5,52.25 R1.2 | IC8.103 31.97,39.21 42.55,49.78 v42.93,49.78
  Bottom 0.204: JP7.3 43.18,53.4 43.18,50.04 v42.93,49.78
USBD_DP
  Top 0.204: JP7.2 43.18,53.4 | 43.18,53.4 45.45,53.4 48.5,50.35 R2.2 | IC8.104 31.72,39.72 43.18,51.18 43.18,53.4
USBD_ID  (via drill 0.3)
  Top 0.204: USB.4 54.35,49.9 53.61,49.9 53.11,49.4 v49.5,49.4 v49.5,49.41 | IC8.102 27.27,38.7 26.8,38.23 v26.8,37.97
  InnerBottom 0.204: JP7.1 40.64,53.4 45.45,53.4 49.44,49.41 v49.5,49.41
  Bottom 0.204: v26.8,37.97 26.8,38.23 27.3,38.73 29.46,38.73 34.16,43.43 37.85,47.12 37.85,50.55 38.1,50.8 38.1,53.34 39.37,54.61 JP7.1
USBD_VBUS  (via drill 0.3)
  Top 0.204: IC8.101 27.94,38.22 27.81,38.22 v27.56,37.97
  Top 0.305: JP7.4 48.4,53.25 50.65,53.25 L1.1
  Bottom 0.204: v27.56,37.97 29.59,37.97 38.61,46.99 41.15,46.99 46.99,52.83 JP7.4
USBH_DM  (via drill 0.3)
  Top 0.204: IC8.75 44.07,25.22 58.04,39.18 58.04,40.77 53.85,44.96 v52.88,44.96
  InnerBottom 0.204: v52.88,44.96 52.83,44.96 45.66,52.13 JP11.1
USBH_DP  (via drill 0.3)
  Top 0.204: IC8.76 43.89,25.73 57.53,39.37 57.53,40.26 53.85,43.94 v52.96,43.94
  InnerBottom 0.204: v52.96,43.94 52.7,43.94 47.12,49.53 45.21,49.53 43.31,51.44 42.61,51.44 JP11.2
USBH_ID  (via drill 0.3)
  Top 0.204: IC8.73 44.67,24.23 59.05,38.61 59.05,41.53 53.57,47.02 46.96,47.02 v46.86,47.12
  InnerBottom 0.204: v46.86,47.12 43.05,47.12 39.37,50.8 JP11.3
USBH_VBUS  (via drill 0.3)
  Top 0.204: IC8.74 44.39,24.71 58.55,38.86 58.55,41.02 53.21,46.35 v47.62,46.35
  InnerBottom 0.204: JP11.4 36.83,51.82 42.29,46.35 v47.62,46.35
VA  (via drill 0.3)
  Top 0.406: v43,9.8 43.26,9.54 IC4.20 43.26,7.05 C408.1 C407.1 | L3.2 36.05,11.55 36.6,11 v36.6,9.8
  InnerTop 0.406: v43,9.8 v36.6,9.8
VBAT  (via drill 0.3)
  Top 0.204: v6.4,42 6.4,39.55 6.75,39.2 7.87,39.2 IC8.6
  InnerTop 0.204: JP15.1 v6.4,42
VD  (via drill 0.3)
  Top 0.305: C405.1 C406.1 43.25,18.25 43.26,16.21 43.26,16.2 v43.25,15.6 v43.26,15.6 IC4.9 | R401.1 v35.3,14.45
  InnerTop 0.305: v35.3,14.45 42.1,14.45 v43.25,15.6
VDDA  (via drill 0.3)
  Top 0.204: 9.38,25.73 v9.4,25.7
  Top 0.254: IC8.33 9.38,25.73 | v7.6,17.85 L4.1
  Top 0.305: C24.1 C27.1 L4.1
  InnerTop 0.254: v9.4,25.7 9.4,19.65 v7.6,17.85

### Text on the board
tPlace: Rev07 | OWL Digital mk2 | Rebel Technology
bPlace: A20 | VBUS | GND | 19 | 18 | 17 | 16 | 15 | 14 | 13 | 12 | 11 | 10 | 9 | 8 | VCC | ID | DP | DM | A21 | A22 | A23 | A24 | A25 | VBAT | Rebel Technology | A | B | 1 | 2 | 3 | 4 | OWL Digital mk2 Rev07 | 5 | 6 | 7 | 5V | GND | 5V | GND | 3V3 | OUTB+ | OUTA+ | OUTB- | OUTA- | VQ1 | INA | INB | VREF | GND | 3V3